# EAGLE design currentBaseBoard_v7 (EAGLE 9.5.1)
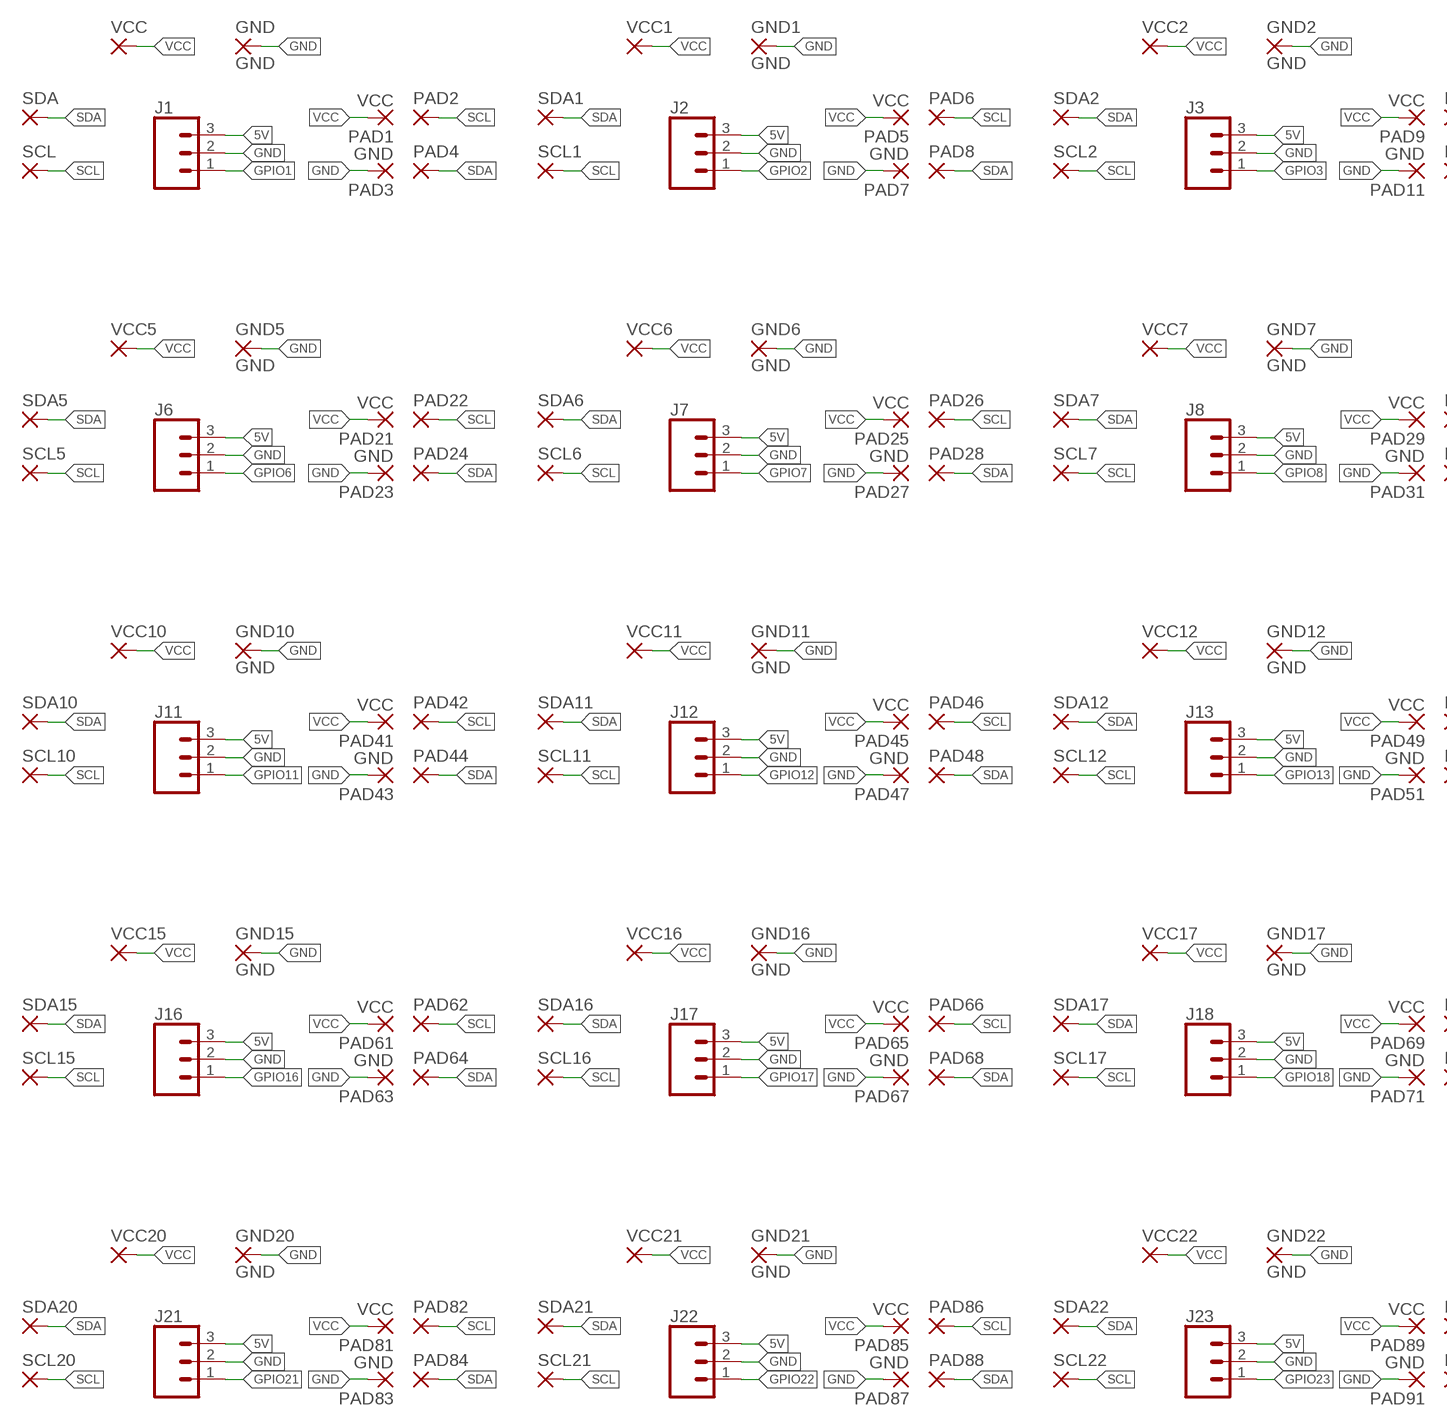
[diagram p0: schematic, sheet 1, part 1 of 2]
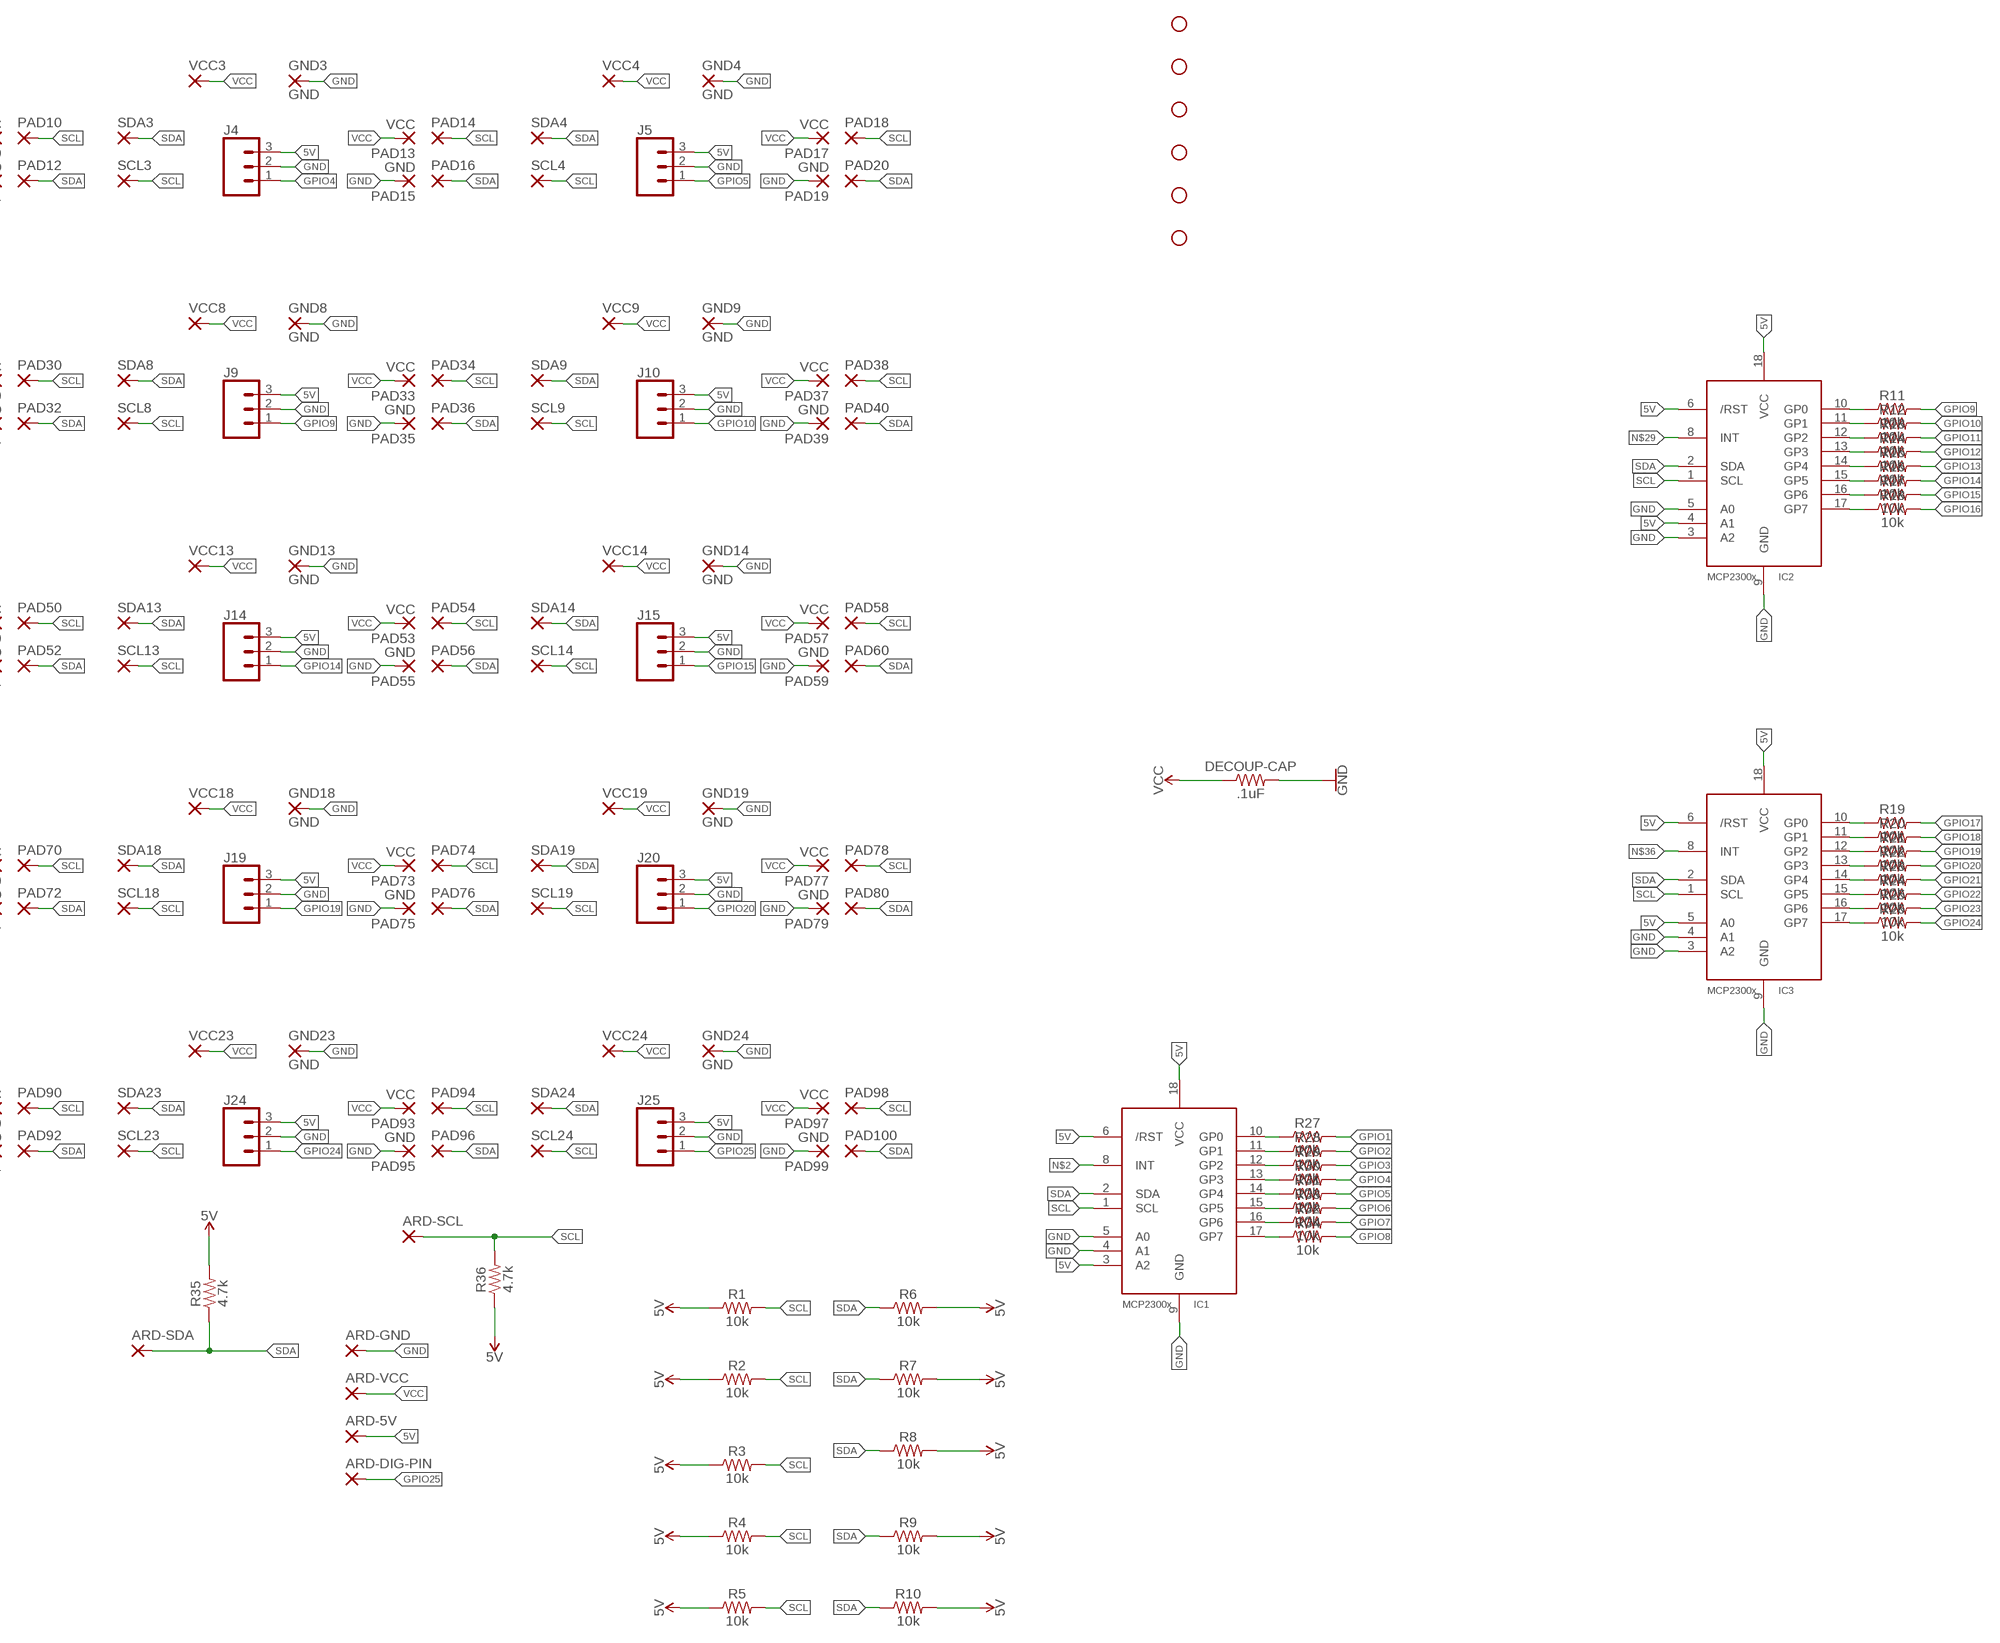
[diagram p1: schematic, sheet 1, part 2 of 2]

## Parts
ARD-5V  2,15/1,0  [2,15/1,0]
ARD-DIG-PIN  2,15/1,0  [2,15/1,0]
ARD-GND  2,15/1,0  [2,15/1,0]
ARD-SCL  2,15/1,0  [2,15/1,0]
ARD-SDA  2,15/1,0  [2,15/1,0]
ARD-VCC  2,15/1,0  [2,15/1,0]
DECOUP-CAP  .1uF  10KOHM-HORIZ-1/6W-5%  [AXIAL-0.3]
GND  GND  2,15/1,0  [2,15/1,0]
GND1  GND  2,15/1,0  [2,15/1,0]
GND2  GND  2,15/1,0  [2,15/1,0]
GND3  GND  2,15/1,0  [2,15/1,0]
GND4  GND  2,15/1,0  [2,15/1,0]
GND5  GND  2,15/1,0  [2,15/1,0]
GND6  GND  2,15/1,0  [2,15/1,0]
GND7  GND  2,15/1,0  [2,15/1,0]
GND8  GND  2,15/1,0  [2,15/1,0]
GND9  GND  2,15/1,0  [2,15/1,0]
GND10  GND  2,15/1,0  [2,15/1,0]
GND11  GND  2,15/1,0  [2,15/1,0]
GND12  GND  2,15/1,0  [2,15/1,0]
GND13  GND  2,15/1,0  [2,15/1,0]
GND14  GND  2,15/1,0  [2,15/1,0]
GND15  GND  2,15/1,0  [2,15/1,0]
GND16  GND  2,15/1,0  [2,15/1,0]
GND17  GND  2,15/1,0  [2,15/1,0]
GND18  GND  2,15/1,0  [2,15/1,0]
GND19  GND  2,15/1,0  [2,15/1,0]
GND20  GND  2,15/1,0  [2,15/1,0]
GND21  GND  2,15/1,0  [2,15/1,0]
GND22  GND  2,15/1,0  [2,15/1,0]
GND23  GND  2,15/1,0  [2,15/1,0]
GND24  GND  2,15/1,0  [2,15/1,0]
H1  STAND-OFF  [STAND-OFF]
H2  STAND-OFF  [STAND-OFF]
H3  STAND-OFF  [STAND-OFF]
H4  STAND-OFF  [STAND-OFF]
H5  STAND-OFF  [STAND-OFF]
H6  STAND-OFF  [STAND-OFF]
IC1  MCP23008/P  [DIL18]
IC2  MCP23008/P  [DIL18]
IC3  MCP23008/P  [DIL18]
J1  CONN_03  [1X03]
J2  CONN_03  [1X03]
J3  CONN_03  [1X03]
J4  CONN_03  [1X03]
J5  CONN_03  [1X03]
J6  CONN_03  [1X03]
J7  CONN_03  [1X03]
J8  CONN_03  [1X03]
J9  CONN_03  [1X03]
J10  CONN_03  [1X03]
J11  CONN_03  [1X03]
J12  CONN_03  [1X03]
J13  CONN_03  [1X03]
J14  CONN_03  [1X03]
J15  CONN_03  [1X03]
J16  CONN_03  [1X03]
J17  CONN_03  [1X03]
J18  CONN_03  [1X03]
J19  CONN_03  [1X03]
J20  CONN_03  [1X03]
J21  CONN_03  [1X03]
J22  CONN_03  [1X03]
J23  CONN_03  [1X03]
J24  CONN_03  [1X03]
J25  CONN_03  [1X03]
PAD1  VCC  2,15/1,0  [2,15/1,0]
PAD2  2,15/1,0  [2,15/1,0]
PAD3  GND  2,15/1,0  [2,15/1,0]
PAD4  2,15/1,0  [2,15/1,0]
PAD5  VCC  2,15/1,0  [2,15/1,0]
PAD6  2,15/1,0  [2,15/1,0]
PAD7  GND  2,15/1,0  [2,15/1,0]
PAD8  2,15/1,0  [2,15/1,0]
PAD9  VCC  2,15/1,0  [2,15/1,0]
PAD10  2,15/1,0  [2,15/1,0]
PAD11  GND  2,15/1,0  [2,15/1,0]
PAD12  2,15/1,0  [2,15/1,0]
PAD13  VCC  2,15/1,0  [2,15/1,0]
PAD14  2,15/1,0  [2,15/1,0]
PAD15  GND  2,15/1,0  [2,15/1,0]
PAD16  2,15/1,0  [2,15/1,0]
PAD17  VCC  2,15/1,0  [2,15/1,0]
PAD18  2,15/1,0  [2,15/1,0]
PAD19  GND  2,15/1,0  [2,15/1,0]
PAD20  2,15/1,0  [2,15/1,0]
PAD21  VCC  2,15/1,0  [2,15/1,0]
PAD22  2,15/1,0  [2,15/1,0]
PAD23  GND  2,15/1,0  [2,15/1,0]
PAD24  2,15/1,0  [2,15/1,0]
PAD25  VCC  2,15/1,0  [2,15/1,0]
PAD26  2,15/1,0  [2,15/1,0]
PAD27  GND  2,15/1,0  [2,15/1,0]
PAD28  2,15/1,0  [2,15/1,0]
PAD29  VCC  2,15/1,0  [2,15/1,0]
PAD30  2,15/1,0  [2,15/1,0]
PAD31  GND  2,15/1,0  [2,15/1,0]
PAD32  2,15/1,0  [2,15/1,0]
PAD33  VCC  2,15/1,0  [2,15/1,0]
PAD34  2,15/1,0  [2,15/1,0]
PAD35  GND  2,15/1,0  [2,15/1,0]
PAD36  2,15/1,0  [2,15/1,0]
PAD37  VCC  2,15/1,0  [2,15/1,0]
PAD38  2,15/1,0  [2,15/1,0]
PAD39  GND  2,15/1,0  [2,15/1,0]
PAD40  2,15/1,0  [2,15/1,0]
PAD41  VCC  2,15/1,0  [2,15/1,0]
PAD42  2,15/1,0  [2,15/1,0]
PAD43  GND  2,15/1,0  [2,15/1,0]
PAD44  2,15/1,0  [2,15/1,0]
PAD45  VCC  2,15/1,0  [2,15/1,0]
PAD46  2,15/1,0  [2,15/1,0]
PAD47  GND  2,15/1,0  [2,15/1,0]
PAD48  2,15/1,0  [2,15/1,0]
PAD49  VCC  2,15/1,0  [2,15/1,0]
PAD50  2,15/1,0  [2,15/1,0]
PAD51  GND  2,15/1,0  [2,15/1,0]
PAD52  2,15/1,0  [2,15/1,0]
PAD53  VCC  2,15/1,0  [2,15/1,0]
PAD54  2,15/1,0  [2,15/1,0]
PAD55  GND  2,15/1,0  [2,15/1,0]
PAD56  2,15/1,0  [2,15/1,0]
PAD57  VCC  2,15/1,0  [2,15/1,0]
PAD58  2,15/1,0  [2,15/1,0]
PAD59  GND  2,15/1,0  [2,15/1,0]
PAD60  2,15/1,0  [2,15/1,0]
PAD61  VCC  2,15/1,0  [2,15/1,0]
PAD62  2,15/1,0  [2,15/1,0]
PAD63  GND  2,15/1,0  [2,15/1,0]
PAD64  2,15/1,0  [2,15/1,0]
PAD65  VCC  2,15/1,0  [2,15/1,0]
PAD66  2,15/1,0  [2,15/1,0]
PAD67  GND  2,15/1,0  [2,15/1,0]
PAD68  2,15/1,0  [2,15/1,0]
PAD69  VCC  2,15/1,0  [2,15/1,0]
PAD70  2,15/1,0  [2,15/1,0]
PAD71  GND  2,15/1,0  [2,15/1,0]
PAD72  2,15/1,0  [2,15/1,0]
PAD73  VCC  2,15/1,0  [2,15/1,0]
PAD74  2,15/1,0  [2,15/1,0]
PAD75  GND  2,15/1,0  [2,15/1,0]
PAD76  2,15/1,0  [2,15/1,0]
PAD77  VCC  2,15/1,0  [2,15/1,0]
PAD78  2,15/1,0  [2,15/1,0]
PAD79  GND  2,15/1,0  [2,15/1,0]
PAD80  2,15/1,0  [2,15/1,0]
PAD81  VCC  2,15/1,0  [2,15/1,0]
PAD82  2,15/1,0  [2,15/1,0]
PAD83  GND  2,15/1,0  [2,15/1,0]
PAD84  2,15/1,0  [2,15/1,0]
PAD85  VCC  2,15/1,0  [2,15/1,0]
PAD86  2,15/1,0  [2,15/1,0]
PAD87  GND  2,15/1,0  [2,15/1,0]
PAD88  2,15/1,0  [2,15/1,0]
PAD89  VCC  2,15/1,0  [2,15/1,0]
PAD90  2,15/1,0  [2,15/1,0]
PAD91  GND  2,15/1,0  [2,15/1,0]
PAD92  2,15/1,0  [2,15/1,0]
PAD93  VCC  2,15/1,0  [2,15/1,0]
PAD94  2,15/1,0  [2,15/1,0]
PAD95  GND  2,15/1,0  [2,15/1,0]
PAD96  2,15/1,0  [2,15/1,0]
PAD97  VCC  2,15/1,0  [2,15/1,0]
PAD98  2,15/1,0  [2,15/1,0]
PAD99  GND  2,15/1,0  [2,15/1,0]
PAD100  2,15/1,0  [2,15/1,0]
R1  10k  10KOHM-HORIZ-1/4W-1%  [AXIAL-0.3]
R2  10k  10KOHM-HORIZ-1/4W-1%  [AXIAL-0.3]
R3  10k  10KOHM-HORIZ-1/4W-1%  [AXIAL-0.3]
R4  10k  10KOHM-HORIZ-1/4W-1%  [AXIAL-0.3]
R5  10k  10KOHM-HORIZ-1/4W-1%  [AXIAL-0.3]
R6  10k  10KOHM-HORIZ-1/4W-1%  [AXIAL-0.3]
R7  10k  10KOHM-HORIZ-1/4W-1%  [AXIAL-0.3]
R8  10k  10KOHM-HORIZ-1/4W-1%  [AXIAL-0.3]
R9  10k  10KOHM-HORIZ-1/4W-1%  [AXIAL-0.3]
R10  10k  10KOHM-HORIZ-1/4W-1%  [AXIAL-0.3]
R11  10k  10KOHM-HORIZ-1/6W-5%  [AXIAL-0.3]
R12  10k  10KOHM-HORIZ-1/6W-5%  [AXIAL-0.3]
R13  10k  10KOHM-HORIZ-1/6W-5%  [AXIAL-0.3]
R14  10k  10KOHM-HORIZ-1/6W-5%  [AXIAL-0.3]
R15  10k  10KOHM-HORIZ-1/6W-5%  [AXIAL-0.3]
R16  10k  10KOHM-HORIZ-1/6W-5%  [AXIAL-0.3]
R17  10k  10KOHM-HORIZ-1/6W-5%  [AXIAL-0.3]
R18  10k  10KOHM-HORIZ-1/6W-5%  [AXIAL-0.3]
R19  10k  10KOHM-HORIZ-1/6W-5%  [AXIAL-0.3]
R20  10k  10KOHM-HORIZ-1/6W-5%  [AXIAL-0.3]
R21  10k  10KOHM-HORIZ-1/6W-5%  [AXIAL-0.3]
R22  10k  10KOHM-HORIZ-1/6W-5%  [AXIAL-0.3]
R23  10k  10KOHM-HORIZ-1/6W-5%  [AXIAL-0.3]
R24  10k  10KOHM-HORIZ-1/6W-5%  [AXIAL-0.3]
R25  10k  10KOHM-HORIZ-1/6W-5%  [AXIAL-0.3]
R26  10k  10KOHM-HORIZ-1/6W-5%  [AXIAL-0.3]
R27  10k  10KOHM-HORIZ-1/6W-5%  [AXIAL-0.3]
R28  10k  10KOHM-HORIZ-1/6W-5%  [AXIAL-0.3]
R29  10k  10KOHM-HORIZ-1/6W-5%  [AXIAL-0.3]
R30  10k  10KOHM-HORIZ-1/6W-5%  [AXIAL-0.3]
R31  10k  10KOHM-HORIZ-1/6W-5%  [AXIAL-0.3]
R32  10k  10KOHM-HORIZ-1/6W-5%  [AXIAL-0.3]
R33  10k  10KOHM-HORIZ-1/6W-5%  [AXIAL-0.3]
R34  10k  10KOHM-HORIZ-1/6W-5%  [AXIAL-0.3]
R35  4.7k  10KOHM-HORIZ-1/4W-1%  [AXIAL-0.3]
R36  4.7k  10KOHM-HORIZ-1/4W-1%  [AXIAL-0.3]
SCL  2,15/1,0  [2,15/1,0]
SCL1  2,15/1,0  [2,15/1,0]
SCL2  2,15/1,0  [2,15/1,0]
SCL3  2,15/1,0  [2,15/1,0]
SCL4  2,15/1,0  [2,15/1,0]
SCL5  2,15/1,0  [2,15/1,0]
SCL6  2,15/1,0  [2,15/1,0]
SCL7  2,15/1,0  [2,15/1,0]
SCL8  2,15/1,0  [2,15/1,0]
SCL9  2,15/1,0  [2,15/1,0]
SCL10  2,15/1,0  [2,15/1,0]
SCL11  2,15/1,0  [2,15/1,0]
SCL12  2,15/1,0  [2,15/1,0]
SCL13  2,15/1,0  [2,15/1,0]
SCL14  2,15/1,0  [2,15/1,0]
SCL15  2,15/1,0  [2,15/1,0]
SCL16  2,15/1,0  [2,15/1,0]
SCL17  2,15/1,0  [2,15/1,0]
SCL18  2,15/1,0  [2,15/1,0]
SCL19  2,15/1,0  [2,15/1,0]
SCL20  2,15/1,0  [2,15/1,0]
SCL21  2,15/1,0  [2,15/1,0]
SCL22  2,15/1,0  [2,15/1,0]
SCL23  2,15/1,0  [2,15/1,0]
SCL24  2,15/1,0  [2,15/1,0]
SDA  2,15/1,0  [2,15/1,0]
SDA1  2,15/1,0  [2,15/1,0]
SDA2  2,15/1,0  [2,15/1,0]
SDA3  2,15/1,0  [2,15/1,0]
SDA4  2,15/1,0  [2,15/1,0]
SDA5  2,15/1,0  [2,15/1,0]
SDA6  2,15/1,0  [2,15/1,0]
SDA7  2,15/1,0  [2,15/1,0]
SDA8  2,15/1,0  [2,15/1,0]
SDA9  2,15/1,0  [2,15/1,0]
SDA10  2,15/1,0  [2,15/1,0]
SDA11  2,15/1,0  [2,15/1,0]
SDA12  2,15/1,0  [2,15/1,0]
SDA13  2,15/1,0  [2,15/1,0]
SDA14  2,15/1,0  [2,15/1,0]
SDA15  2,15/1,0  [2,15/1,0]
SDA16  2,15/1,0  [2,15/1,0]
SDA17  2,15/1,0  [2,15/1,0]
SDA18  2,15/1,0  [2,15/1,0]
SDA19  2,15/1,0  [2,15/1,0]
SDA20  2,15/1,0  [2,15/1,0]
SDA21  2,15/1,0  [2,15/1,0]
SDA22  2,15/1,0  [2,15/1,0]
SDA23  2,15/1,0  [2,15/1,0]
SDA24  2,15/1,0  [2,15/1,0]
VCC  2,15/1,0  [2,15/1,0]
VCC1  2,15/1,0  [2,15/1,0]
VCC2  2,15/1,0  [2,15/1,0]
VCC3  2,15/1,0  [2,15/1,0]
VCC4  2,15/1,0  [2,15/1,0]
VCC5  2,15/1,0  [2,15/1,0]
VCC6  2,15/1,0  [2,15/1,0]
VCC7  2,15/1,0  [2,15/1,0]
VCC8  2,15/1,0  [2,15/1,0]
VCC9  2,15/1,0  [2,15/1,0]
VCC10  2,15/1,0  [2,15/1,0]
VCC11  2,15/1,0  [2,15/1,0]
VCC12  2,15/1,0  [2,15/1,0]
VCC13  2,15/1,0  [2,15/1,0]
VCC14  2,15/1,0  [2,15/1,0]
VCC15  2,15/1,0  [2,15/1,0]
VCC16  2,15/1,0  [2,15/1,0]
VCC17  2,15/1,0  [2,15/1,0]
VCC18  2,15/1,0  [2,15/1,0]
VCC19  2,15/1,0  [2,15/1,0]
VCC20  2,15/1,0  [2,15/1,0]
VCC21  2,15/1,0  [2,15/1,0]
VCC22  2,15/1,0  [2,15/1,0]
VCC23  2,15/1,0  [2,15/1,0]
VCC24  2,15/1,0  [2,15/1,0]

## Nets
5V: ARD-5V.1(P) IC1.3(A2) IC1.6(/RST) IC1.18(VCC) IC2.4(A1) IC2.6(/RST) IC2.18(VCC) IC3.5(A0) IC3.6(/RST) IC3.18(VCC) J1.3 J2.3 J3.3 J4.3 J5.3 J6.3 J7.3 J8.3 J9.3 J10.3 J11.3 J12.3 J13.3 J14.3 J15.3 J16.3 J17.3 J18.3 J19.3 J20.3 J21.3 J22.3 J23.3 J24.3 J25.3 R1.P$1 R2.P$1 R3.P$1 R4.P$1 R5.P$1 R6.P$2 R7.P$2 R8.P$2 R9.P$2 R10.P$2 R35.P$2 R36.P$1
GND: ARD-GND.1(P) DECOUP-CAP.P$2 GND1.1(P) GND2.1(P) GND3.1(P) GND4.1(P) GND5.1(P) GND6.1(P) GND7.1(P) GND8.1(P) GND9.1(P) GND10.1(P) GND11.1(P) GND12.1(P) GND13.1(P) GND14.1(P) GND15.1(P) GND16.1(P) GND17.1(P) GND18.1(P) GND19.1(P) GND20.1(P) GND21.1(P) GND22.1(P) GND23.1(P) GND24.1(P) GND.1(P) IC1.4(A1) IC1.5(A0) IC1.9(GND) IC2.3(A2) IC2.5(A0) IC2.9(GND) IC3.3(A2) IC3.4(A1) IC3.9(GND) J1.2 J2.2 J3.2 J4.2 J5.2 J6.2 J7.2 J8.2 J9.2 J10.2 J11.2 J12.2 J13.2 J14.2 J15.2 J16.2 J17.2 J18.2 J19.2 J20.2 J21.2 J22.2 J23.2 J24.2 J25.2 PAD3.1(P) PAD7.1(P) PAD11.1(P) PAD15.1(P) PAD19.1(P) PAD23.1(P) PAD27.1(P) PAD31.1(P) PAD35.1(P) PAD39.1(P) PAD43.1(P) PAD47.1(P) PAD51.1(P) PAD55.1(P) PAD59.1(P) PAD63.1(P) PAD67.1(P) PAD71.1(P) PAD75.1(P) PAD79.1(P) PAD83.1(P) PAD87.1(P) PAD91.1(P) PAD95.1(P) PAD99.1(P)
GPIO1: J1.1 R27.P$2
GPIO2: J2.1 R28.P$2
GPIO3: J3.1 R29.P$2
GPIO4: J4.1 R30.P$2
GPIO5: J5.1 R31.P$2
GPIO6: J6.1 R33.P$2
GPIO7: J7.1 R32.P$2
GPIO8: J8.1 R34.P$2
GPIO9: J9.1 R11.P$2
GPIO10: J10.1 R12.P$2
GPIO11: J11.1 R13.P$2
GPIO12: J12.1 R14.P$2
GPIO13: J13.1 R15.P$2
GPIO14: J14.1 R16.P$2
GPIO15: J15.1 R17.P$2
GPIO16: J16.1 R18.P$2
GPIO17: J17.1 R19.P$2
GPIO18: J18.1 R20.P$2
GPIO19: J19.1 R21.P$2
GPIO20: J20.1 R22.P$2
GPIO21: J21.1 R23.P$2
GPIO22: J22.1 R24.P$2
GPIO23: J23.1 R25.P$2
GPIO24: J24.1 R26.P$2
GPIO25: ARD-DIG-PIN.1(P) J25.1
N$1: IC1.10(GP0) R27.P$1
N$2: IC1.8(INT)
N$3: IC1.11(GP1) R28.P$1
N$4: IC1.12(GP2) R29.P$1
N$5: IC1.13(GP3) R30.P$1
N$6: IC1.14(GP4) R31.P$1
N$7: IC1.15(GP5) R33.P$1
N$8: IC1.16(GP6) R32.P$1
N$9: IC1.17(GP7) R34.P$1
N$10: IC2.10(GP0) R11.P$1
N$12: IC2.11(GP1) R12.P$1
N$13: IC2.12(GP2) R13.P$1
N$14: IC2.13(GP3) R14.P$1
N$15: IC2.14(GP4) R15.P$1
N$16: IC2.15(GP5) R16.P$1
N$17: IC2.16(GP6) R17.P$1
N$18: IC2.17(GP7) R18.P$1
N$19: IC3.10(GP0) R19.P$1
N$20: IC3.11(GP1) R20.P$1
N$21: IC3.12(GP2) R21.P$1
N$22: IC3.13(GP3) R22.P$1
N$23: IC3.14(GP4) R23.P$1
N$24: IC3.15(GP5) R24.P$1
N$25: IC3.16(GP6) R25.P$1
N$26: IC3.17(GP7) R26.P$1
N$29: IC2.8(INT)
N$36: IC3.8(INT)
SCL: ARD-SCL.1(P) IC1.1(SCL) IC2.1(SCL) IC3.1(SCL) PAD2.1(P) PAD6.1(P) PAD10.1(P) PAD14.1(P) PAD18.1(P) PAD22.1(P) PAD26.1(P) PAD30.1(P) PAD34.1(P) PAD38.1(P) PAD42.1(P) PAD46.1(P) PAD50.1(P) PAD54.1(P) PAD58.1(P) PAD62.1(P) PAD66.1(P) PAD70.1(P) PAD74.1(P) PAD78.1(P) PAD82.1(P) PAD86.1(P) PAD90.1(P) PAD94.1(P) PAD98.1(P) R1.P$2 R2.P$2 R3.P$2 R4.P$2 R5.P$2 R36.P$2 SCL1.1(P) SCL2.1(P) SCL3.1(P) SCL4.1(P) SCL5.1(P) SCL6.1(P) SCL7.1(P) SCL8.1(P) SCL9.1(P) SCL10.1(P) SCL11.1(P) SCL12.1(P) SCL13.1(P) SCL14.1(P) SCL15.1(P) SCL16.1(P) SCL17.1(P) SCL18.1(P) SCL19.1(P) SCL20.1(P) SCL21.1(P) SCL22.1(P) SCL23.1(P) SCL24.1(P) SCL.1(P)
SDA: ARD-SDA.1(P) IC1.2(SDA) IC2.2(SDA) IC3.2(SDA) PAD4.1(P) PAD8.1(P) PAD12.1(P) PAD16.1(P) PAD20.1(P) PAD24.1(P) PAD28.1(P) PAD32.1(P) PAD36.1(P) PAD40.1(P) PAD44.1(P) PAD48.1(P) PAD52.1(P) PAD56.1(P) PAD60.1(P) PAD64.1(P) PAD68.1(P) PAD72.1(P) PAD76.1(P) PAD80.1(P) PAD84.1(P) PAD88.1(P) PAD92.1(P) PAD96.1(P) PAD100.1(P) R6.P$1 R7.P$1 R8.P$1 R9.P$1 R10.P$1 R35.P$1 SDA1.1(P) SDA2.1(P) SDA3.1(P) SDA4.1(P) SDA5.1(P) SDA6.1(P) SDA7.1(P) SDA8.1(P) SDA9.1(P) SDA10.1(P) SDA11.1(P) SDA12.1(P) SDA13.1(P) SDA14.1(P) SDA15.1(P) SDA16.1(P) SDA17.1(P) SDA18.1(P) SDA19.1(P) SDA20.1(P) SDA21.1(P) SDA22.1(P) SDA23.1(P) SDA24.1(P) SDA.1(P)
VCC: ARD-VCC.1(P) DECOUP-CAP.P$1 PAD1.1(P) PAD5.1(P) PAD9.1(P) PAD13.1(P) PAD17.1(P) PAD21.1(P) PAD25.1(P) PAD29.1(P) PAD33.1(P) PAD37.1(P) PAD41.1(P) PAD45.1(P) PAD49.1(P) PAD53.1(P) PAD57.1(P) PAD61.1(P) PAD65.1(P) PAD69.1(P) PAD73.1(P) PAD77.1(P) PAD81.1(P) PAD85.1(P) PAD89.1(P) PAD93.1(P) PAD97.1(P) VCC1.1(P) VCC2.1(P) VCC3.1(P) VCC4.1(P) VCC5.1(P) VCC6.1(P) VCC7.1(P) VCC8.1(P) VCC9.1(P) VCC10.1(P) VCC11.1(P) VCC12.1(P) VCC13.1(P) VCC14.1(P) VCC15.1(P) VCC16.1(P) VCC17.1(P) VCC18.1(P) VCC19.1(P) VCC20.1(P) VCC21.1(P) VCC22.1(P) VCC23.1(P) VCC24.1(P) VCC.1(P)

## Library data of the parts
ARD-5V ARD-DIG-PIN ARD-GND ARD-SCL ARD-SDA ARD-VCC GND GND1-GND24 PAD1-PAD100 SCL SCL1-SCL24 SDA SDA1-SDA24 VCC VCC1-VCC24 = wirepad:2,15/1,0: THROUGH-HOLE PAD
DECOUP-CAP = SparkFun-Resistors:10KOHM: 10kΩ resistor A resistor is a passive two-terminal electrical component that implements electrical resistance as a circuit element. Resistors act to reduce current flow, and, at the same time, act to lower voltage levels within circuits. - Wikipedia; PROD_ID: RES-08375; VALUE: 10k
H1-H6 = SparkFun-Hardware:STAND-OFF: Stand Off Drill holes for mechanically mounting via screws, standoffs, etc. Note: Use the keepout ring to avoid running the screw head into surrounding components. Variant Overviews STAND-OFF - Mechanical footprint for a #4 phillips button head screw. STAND-OFF-TIGHT - Mechanical footprint for a #4 phillips button head screw, Example SparkFun Products Screw - Phillips Head (1/4", 4-40, 10 pack) <https://www.sparkfun.com/products/10453> (PRT-10453) Screw - Phillips Head (1/2", 4-40, 10 pack) <https://www.sparkfun.com/products/10452> (PRT-10452) Screw - Phillips Head (3/4", 4-40, 10 pack) <https://www.sparkfun.com/products/10451> (PRT-10451) Screw - Phillips Head (1", 4-40, 10 pack) <https://www.sparkfun.com/products/10450> (PRT-10450)
IC1-IC3 = adafruit:MCP23008: MCP23008 Inexpensive i2c i/o expander - 8 general purpose i/o pins with optional pullups
J1-J25 = SparkFun-Connectors:CONN_03: Multi connection point. Often used as Generic Header-pin footprint for 0.1 inch spaced/style header connections On any of the 0.1 inch spaced packages, you can populate with these: Break Away Headers - Straight <https://www.sparkfun.com/products/116> (PRT-00116) Break Away Male Headers - Right Angle <https://www.sparkfun.com/products/553> (PRT-00553) Female Headers <https://www.sparkfun.com/products/115> (PRT-00115) Break Away Headers - Machine Pin <https://www.sparkfun.com/products/117> (PRT-00117) Break Away Female Headers - Swiss Machine Pin <https://www.sparkfun.com/products/743> (PRT-00743) Stackable Header - 3 Pin (Female, 0.1") <https://www.sparkfun.com/products/13875> (PRT-13875) For SCREWTERMINALS and SPRING TERMINALS visit here: Screw Terimnals on SparkFun.com <https://www.sparkfun.com/search/results?term=Screw+Terminals> (5mm/3.5mm/2.54mm spacing) This device is also useful as a general connection point to wire up your design to another part of your project. Our various solder wires solder well into these plated through hole pads. Hook-Up Wire - Assortment (Stranded, 22 AWG) <https://www.sparkfun.com/products/11375> (PRT-11375) Hook-Up Wire - Assortment (Solid Core, 22 AWG) <https://www.sparkfun.com/products/11367> (PRT-11367) View the entire wire category on our website here <https://www.sparkfun.com/categories/141> Special notes: Molex polarized connector foot print use with SKU : PRT-08232 with associated crimp pins and housings.
R1-R10 = SparkFun-Resistors:10KOHM: 10kΩ resistor A resistor is a passive two-terminal electrical component that implements electrical resistance as a circuit element. Resistors act to reduce current flow, and, at the same time, act to lower voltage levels within circuits. - Wikipedia; PROD_ID: RES-12183
R11-R34 = SparkFun-Resistors:10KOHM: 10kΩ resistor A resistor is a passive two-terminal electrical component that implements electrical resistance as a circuit element. Resistors act to reduce current flow, and, at the same time, act to lower voltage levels within circuits. - Wikipedia; PROD_ID: RES-08375
R35 R36 = SparkFun-Resistors:10KOHM: 10kΩ resistor A resistor is a passive two-terminal electrical component that implements electrical resistance as a circuit element. Resistors act to reduce current flow, and, at the same time, act to lower voltage levels within circuits. - Wikipedia; PROD_ID: RES-12183; VALUE: 10k

## Board
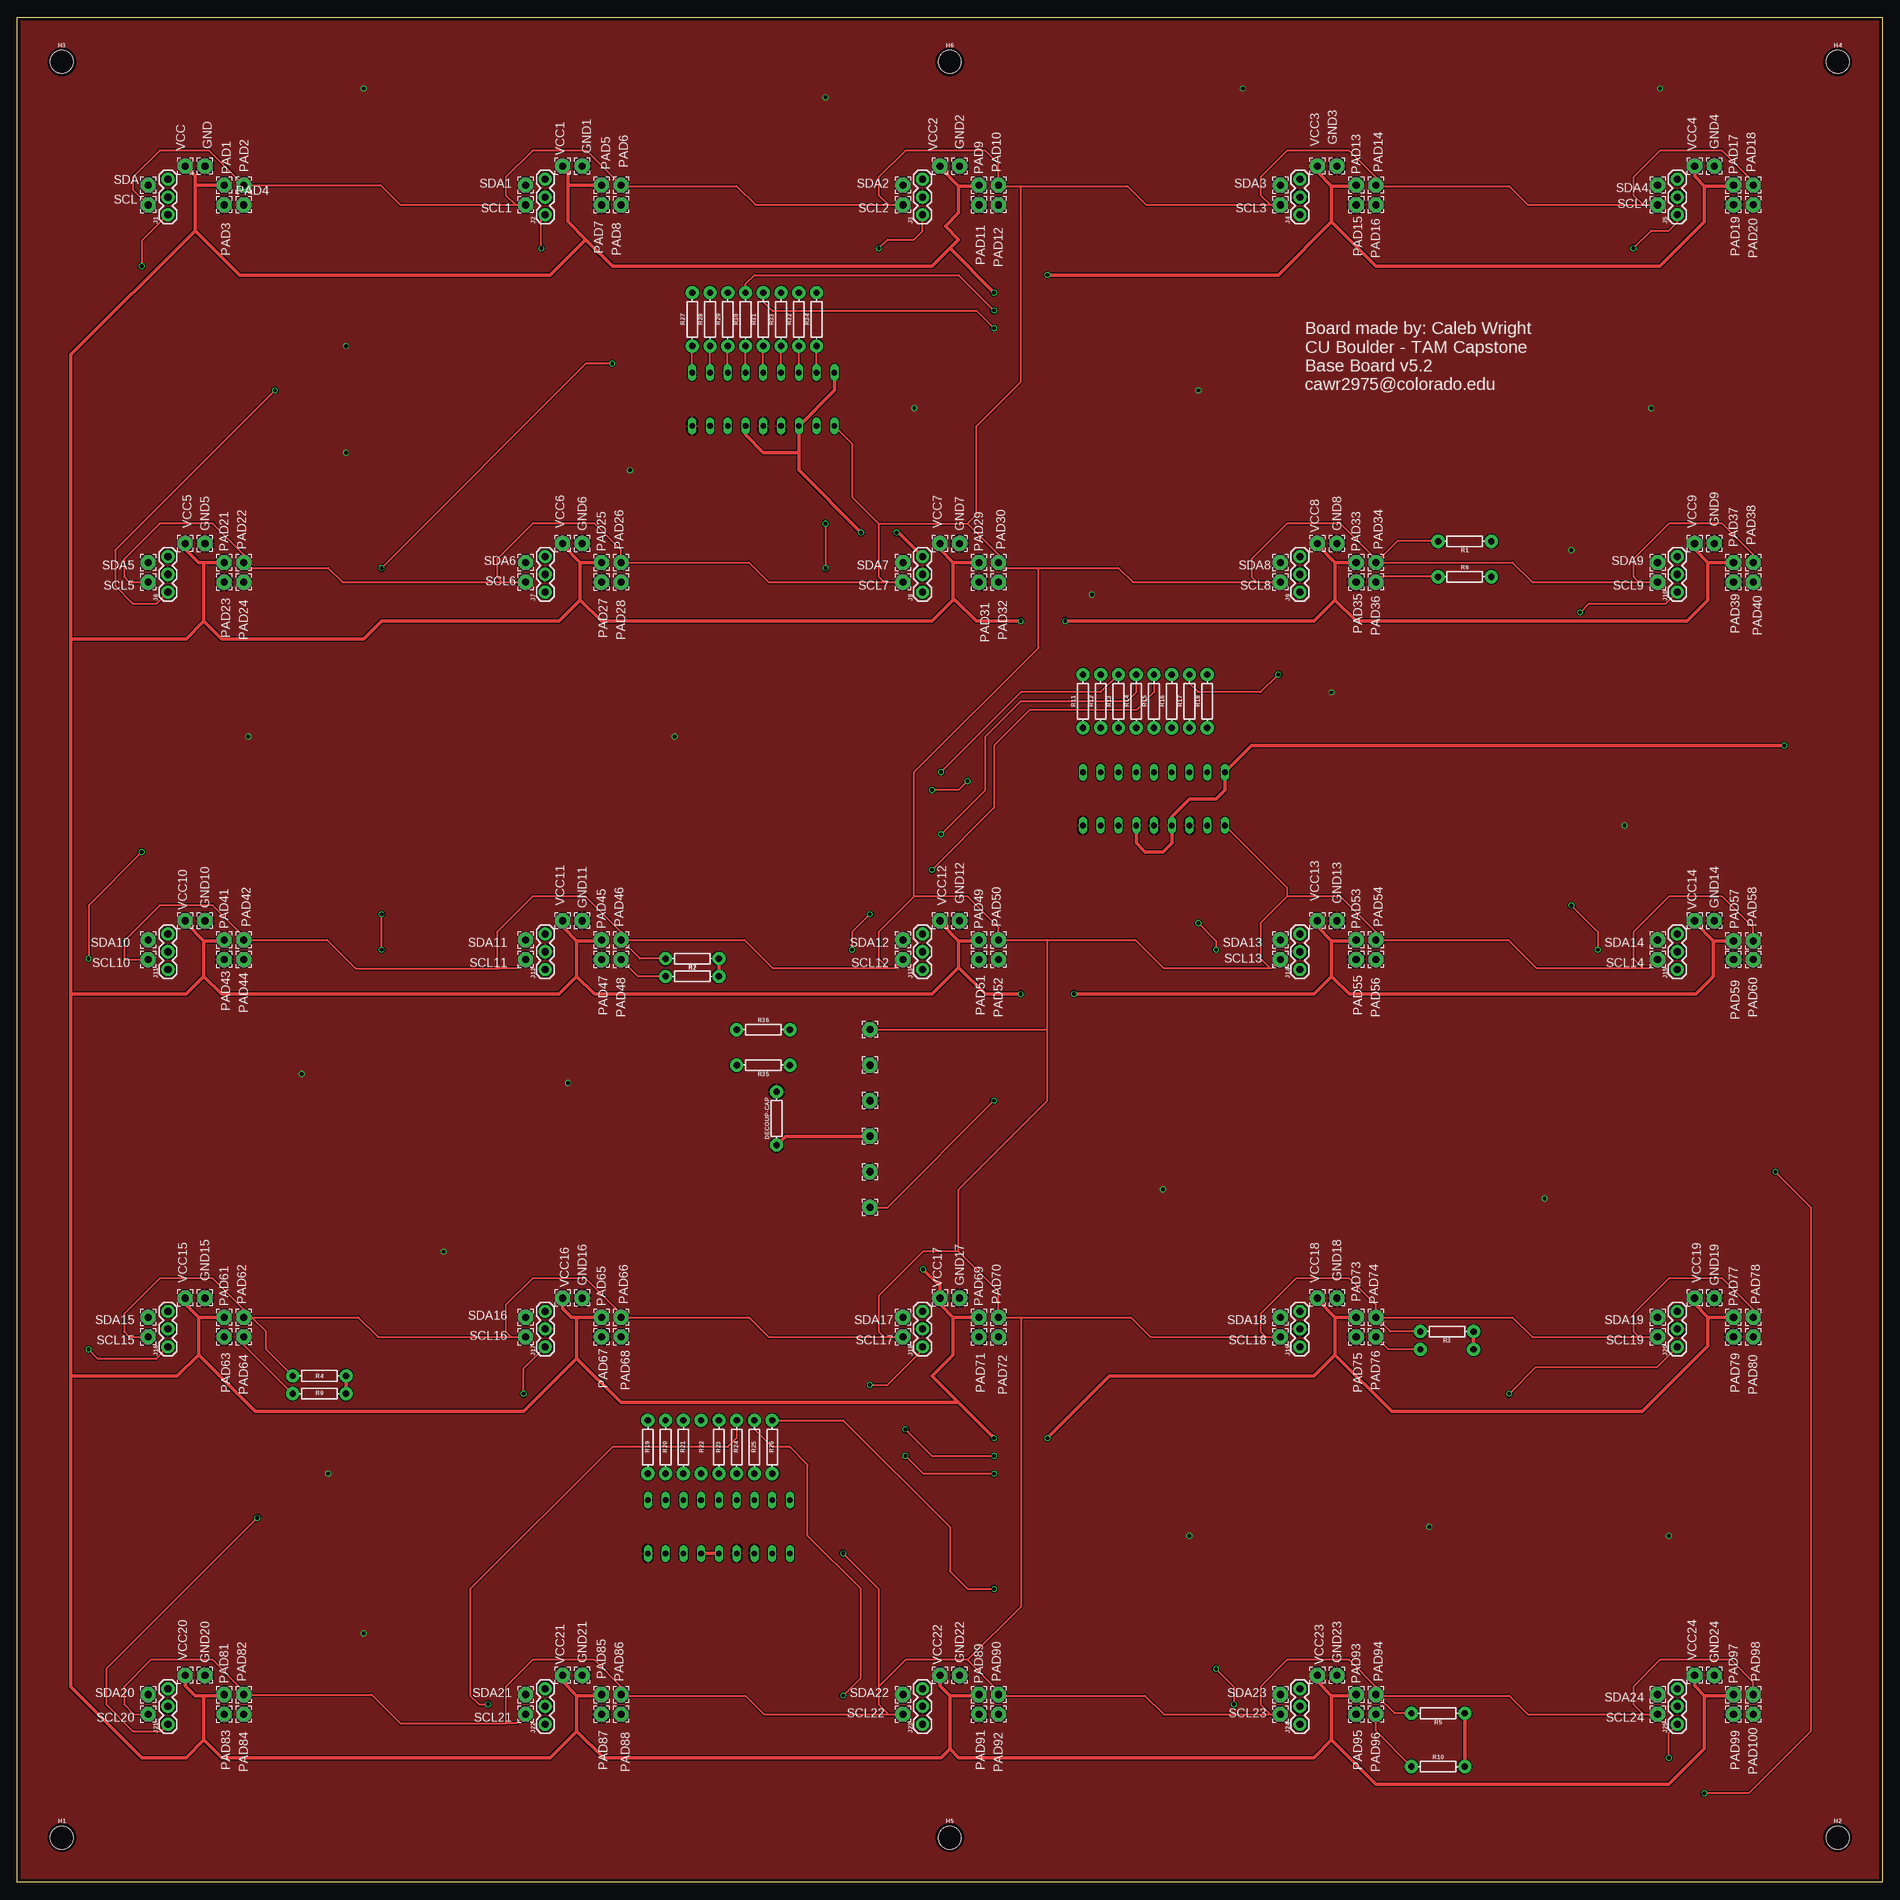
[diagram p2: board, top side]
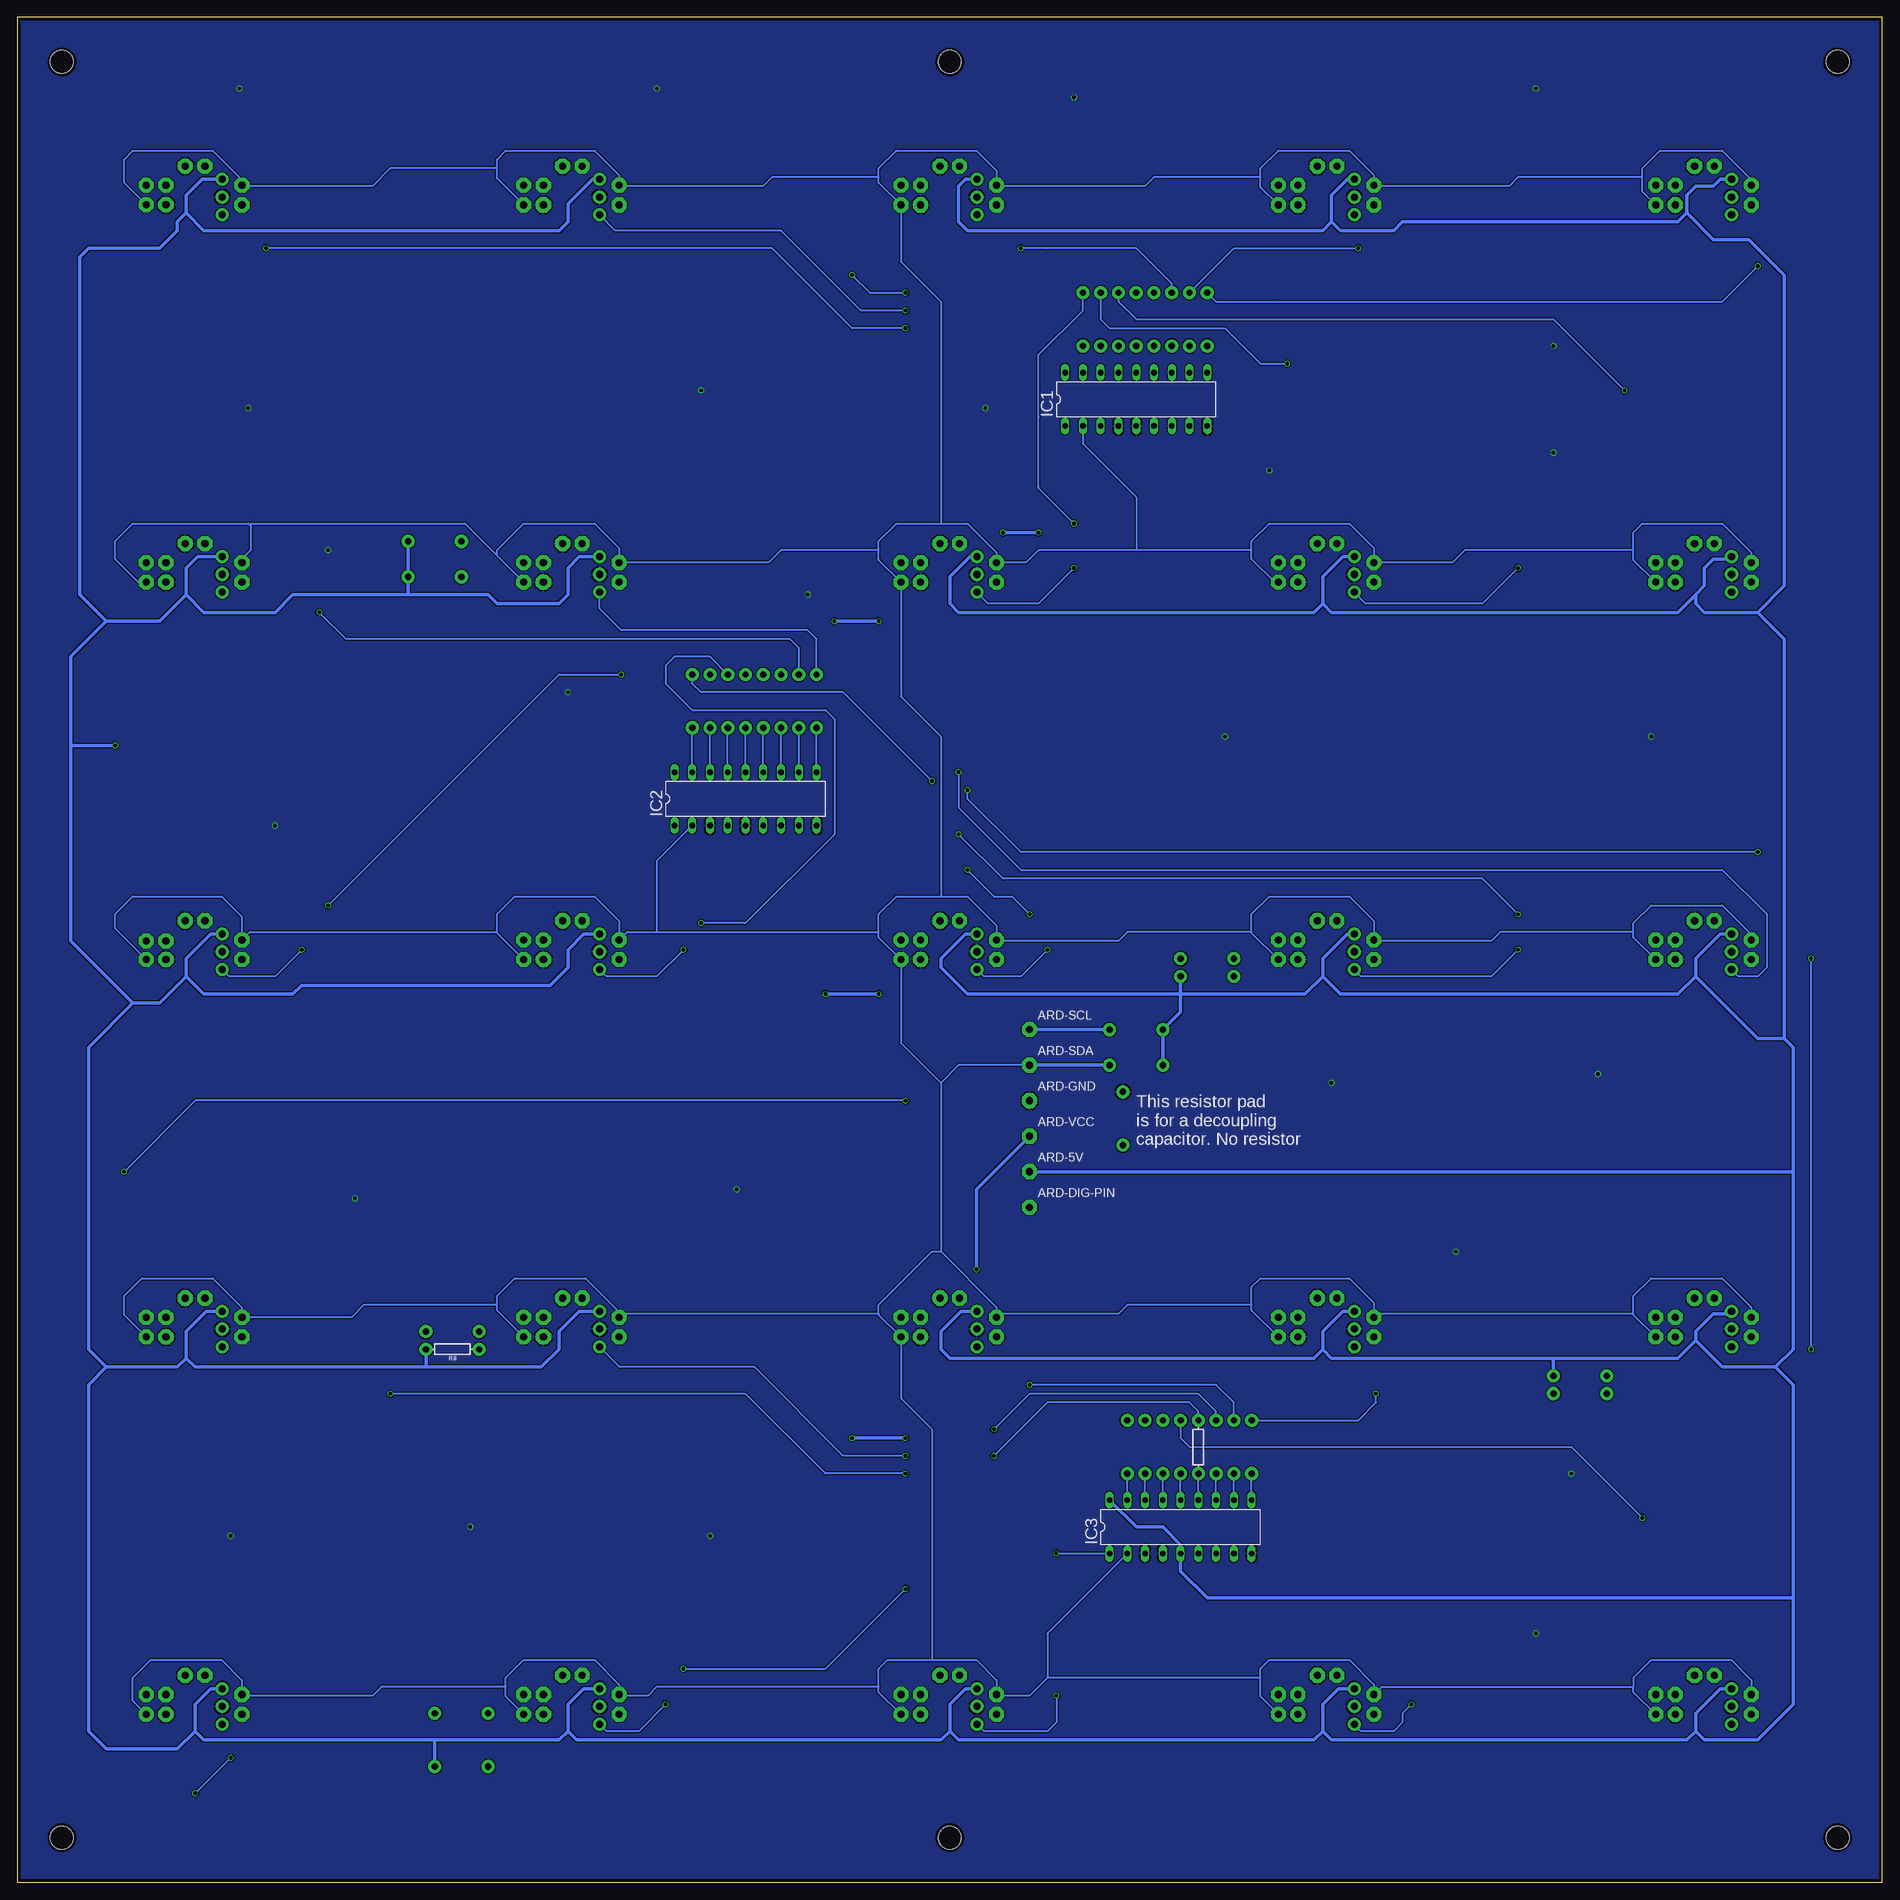
[diagram p3: board, bottom side, seen from below]

Size 266.7 x 266.7 mm. Coordinates in mm from the lower left corner, seen from the top.
Outline: 0,0 0,266.7 266.7,266.7 266.7,0 0,0
Copper layers (1*16): Top 0.035559375mm / dielectric 1.6mm / Bottom 0.035559375mm
Design rules "OSH_2Layer": minimum track width 6mil, minimum drill 10mil, track to track 6mil, track to pad 6mil, pad to pad 6mil, via to via 6mil, smd to smd 6mil, copper to edge 15mil, drill to drill 6mil, minimum pad ring 5mil, minimum via ring 5mil, stop-mask expansion 2.5mil, vias tented up to drill 0mil, thermal gap 10mil

### Footprints (pad centres in the part's own frame; a part is rotated, then mirrored left to right if it is on the bottom)
2,15/1,0 = drill 1.016 pad 2.159 octagon: 1 0,0
AXIAL-0.3 = drill 0.9 pad 1.88: P$1 -3.81,0; P$2 3.81,0
STAND-OFF = hole 3.302: 0,0
DIL18 = drill 0.813 long: 1 -10.16,-3.81; 2 -7.62,-3.81; 3 -5.08,-3.81; 4 -2.54,-3.81; 5 0,-3.81; 6 2.54,-3.81; 7 5.08,-3.81; 8 7.62,-3.81; 9 10.16,-3.81; 10 10.16,3.81; 11 7.62,3.81; 12 5.08,3.81; 13 2.54,3.81; 14 0,3.81; 15 -2.54,3.81; 16 -5.08,3.81; 17 -7.62,3.81; 18 -10.16,3.81
1X03 = drill 1.016 pad 1.88: 1 0,0; 2 2.54,0; 3 5.08,0

### Placement (x,y rotation side)
ARD-5V  121.92,101.6 0 top
ARD-DIG-PIN  121.92,96.52 0 top
ARD-GND  121.92,111.76 0 top
ARD-SCL  121.92,121.92 0 top
ARD-SDA  121.92,116.84 0 top
ARD-VCC  121.92,106.68 0 top
DECOUP-CAP  108.58,109.22 90 top
GND  26.81,245.45 0 top
GND1  80.79,245.45 0 top
GND2  134.76,245.45 0 top
GND3  188.74,245.45 0 top
GND4  242.71,245.45 0 top
GND5  26.81,191.47 0 top
GND6  80.79,191.47 0 top
GND7  134.76,191.47 0 top
GND8  188.74,191.47 0 top
GND9  242.71,191.47 0 top
GND10  26.81,137.5 0 top
GND11  80.79,137.5 0 top
GND12  134.76,137.5 0 top
GND13  188.74,137.5 0 top
GND14  242.71,137.5 0 top
GND15  26.81,83.52 0 top
GND16  80.79,83.52 0 top
GND17  134.76,83.52 0 top
GND18  188.74,83.52 0 top
GND19  242.71,83.52 0 top
GND20  26.81,29.55 0 top
GND21  80.79,29.55 0 top
GND22  134.76,29.55 0 top
GND23  188.74,29.55 0 top
GND24  242.71,29.55 0 top
H1  6.35,6.35 0 top
H2  260.35,6.35 0 top
H3  6.35,260.35 0 top
H4  260.35,260.35 0 top
H5  133.35,6.35 0 top
H6  133.35,260.35 0 top
IC1  106.68,212.09 0 bottom
IC2  162.56,154.94 0 bottom
IC3  100.33,50.8 0 bottom
J1  21.52,238.48 90 top
J2  75.49,238.48 90 top
J3  129.47,238.48 90 top
J4  183.44,238.48 90 top
J5  237.42,238.48 90 top
J6  21.52,184.5 90 top
J7  75.49,184.5 90 top
J8  129.47,184.5 90 top
J9  183.44,184.5 90 top
J10  237.42,184.5 90 top
J11  21.52,130.53 90 top
J12  75.49,130.53 90 top
J13  129.47,130.53 90 top
J14  183.44,130.53 90 top
J15  237.42,130.53 90 top
J16  21.52,76.55 90 top
J17  75.49,76.55 90 top
J18  129.47,76.55 90 top
J19  183.44,76.55 90 top
J20  237.42,76.55 90 top
J21  21.52,22.58 90 top
J22  75.49,22.58 90 top
J23  129.47,22.58 90 top
J24  183.44,22.58 90 top
J25  237.42,22.58 90 top
PAD1  29.56,242.71 0 top
PAD2  32.38,242.71 0 top
PAD3  29.56,239.89 0 top
PAD4  32.38,239.89 0 top
PAD5  83.53,242.71 0 top
PAD6  86.35,242.71 0 top
PAD7  83.53,239.89 0 top
PAD8  86.35,239.89 0 top
PAD9  137.51,242.71 0 top
PAD10  140.33,242.71 0 top
PAD11  137.51,239.89 0 top
PAD12  140.33,239.89 0 top
PAD13  191.48,242.71 0 top
PAD14  194.3,242.71 0 top
PAD15  191.48,239.89 0 top
PAD16  194.3,239.89 0 top
PAD17  245.46,242.71 0 top
PAD18  248.28,242.71 0 top
PAD19  245.46,239.9 0 top
PAD20  248.28,239.9 0 top
PAD21  29.56,188.74 0 top
PAD22  32.38,188.74 0 top
PAD23  29.56,185.91 0 top
PAD24  32.38,185.91 0 top
PAD25  83.53,188.74 0 top
PAD26  86.35,188.74 0 top
PAD27  83.53,185.91 0 top
PAD28  86.35,185.91 0 top
PAD29  137.51,188.74 0 top
PAD30  140.33,188.74 0 top
PAD31  137.51,185.91 0 top
PAD32  140.33,185.91 0 top
PAD33  191.48,188.74 0 top
PAD34  194.3,188.74 0 top
PAD35  191.48,185.91 0 top
PAD36  194.3,185.91 0 top
PAD37  245.46,188.74 0 top
PAD38  248.28,188.74 0 top
PAD39  245.46,185.91 0 top
PAD40  248.28,185.91 0 top
PAD41  29.56,134.76 0 top
PAD42  32.38,134.76 0 top
PAD43  29.56,131.93 0 top
PAD44  32.38,131.94 0 top
PAD45  83.53,134.76 0 top
PAD46  86.35,134.76 0 top
PAD47  83.53,131.94 0 top
PAD48  86.35,131.94 0 top
PAD49  137.51,134.76 0 top
PAD50  140.33,134.76 0 top
PAD51  137.51,131.94 0 top
PAD52  140.33,131.94 0 top
PAD53  191.48,134.76 0 top
PAD54  194.3,134.76 0 top
PAD55  191.48,131.94 0 top
PAD56  194.3,131.94 0 top
PAD57  245.46,134.62 0 top
PAD58  248.28,134.62 0 top
PAD59  245.46,131.94 0 top
PAD60  248.28,131.94 0 top
PAD61  29.56,80.79 0 top
PAD62  32.38,80.79 0 top
PAD63  29.56,77.96 0 top
PAD64  32.38,77.96 0 top
PAD65  83.53,80.79 0 top
PAD66  86.35,80.79 0 top
PAD67  83.53,77.96 0 top
PAD68  86.35,77.96 0 top
PAD69  137.51,80.79 0 top
PAD70  140.33,80.79 0 top
PAD71  137.51,77.96 0 top
PAD72  140.33,77.96 0 top
PAD73  191.48,80.79 0 top
PAD74  194.3,80.79 0 top
PAD75  191.48,77.96 0 top
PAD76  194.3,77.96 0 top
PAD77  245.46,80.79 0 top
PAD78  248.28,80.79 0 top
PAD79  245.46,77.96 0 top
PAD80  248.28,77.96 0 top
PAD81  29.56,26.81 0 top
PAD82  32.38,26.81 0 top
PAD83  29.56,23.99 0 top
PAD84  32.38,23.99 0 top
PAD85  83.53,26.81 0 top
PAD86  86.35,26.81 0 top
PAD87  83.53,23.99 0 top
PAD88  86.35,23.99 0 top
PAD89  137.51,26.81 0 top
PAD90  140.33,26.81 0 top
PAD91  137.51,23.99 0 top
PAD92  140.33,23.99 0 top
PAD93  191.48,26.81 0 top
PAD94  194.3,26.81 0 top
PAD95  191.48,23.99 0 top
PAD96  194.3,23.99 0 top
PAD97  245.46,26.81 0 top
PAD98  248.28,26.81 0 top
PAD99  245.46,23.99 0 top
PAD100  248.28,23.99 0 top
R1  207.01,191.77 180 top
R2  96.52,132.08 180 top
R3  204.47,78.74 180 top
R4  43.18,72.39 180 top
R5  203.2,24.13 180 top
R6  207.01,186.69 0 top
R7  96.52,129.54 0 top
R8  204.47,76.2 180 bottom
R9  43.18,69.85 0 top
R10  203.2,16.51 0 top
R11  152.4,168.91 90 top
R12  154.94,168.91 90 top
R13  157.48,168.91 90 top
R14  160.02,168.91 90 top
R15  162.56,168.91 90 top
R16  165.1,168.91 90 top
R17  167.64,168.91 90 top
R18  170.18,168.91 90 top
R19  90.17,62.23 90 top
R20  92.71,62.23 90 top
R21  95.25,62.23 90 top
R22  97.79,62.23 90 bottom
R23  100.33,62.23 90 top
R24  102.87,62.23 90 top
R25  105.41,62.23 90 top
R26  107.95,62.23 90 top
R27  96.52,223.52 90 top
R28  99.06,223.52 90 top
R29  101.6,223.52 90 top
R30  104.14,223.52 90 top
R31  106.68,223.52 90 top
R32  111.76,223.52 90 top
R33  109.22,223.52 90 top
R34  114.3,223.52 90 top
R35  106.68,116.84 180 top
R36  106.68,121.92 0 top
SCL  18.7,239.89 0 top
SCL1  72.67,239.89 0 top
SCL2  126.65,239.89 0 top
SCL3  180.62,239.89 0 top
SCL4  234.6,239.89 0 top
SCL5  18.7,185.91 0 top
SCL6  72.67,185.91 0 top
SCL7  126.65,185.91 0 top
SCL8  180.62,185.91 0 top
SCL9  234.6,185.91 0 top
SCL10  18.7,131.94 0 top
SCL11  72.67,131.94 0 top
SCL12  126.65,131.94 0 top
SCL13  180.62,131.94 0 top
SCL14  234.6,131.94 0 top
SCL15  18.7,77.96 0 top
SCL16  72.67,77.96 0 top
SCL17  126.65,77.96 0 top
SCL18  180.62,77.96 0 top
SCL19  234.6,77.96 0 top
SCL20  18.7,23.99 0 top
SCL21  72.67,23.99 0 top
SCL22  126.65,23.99 0 top
SCL23  180.62,23.99 0 top
SCL24  234.6,23.99 0 top
SDA  18.7,242.71 0 top
SDA1  72.67,242.71 0 top
SDA2  126.65,242.71 0 top
SDA3  180.62,242.71 0 top
SDA4  234.6,242.71 0 top
SDA5  18.7,188.74 0 top
SDA6  72.67,188.74 0 top
SDA7  126.65,188.74 0 top
SDA8  180.62,188.74 0 top
SDA9  234.6,188.74 0 top
SDA10  18.7,134.76 0 top
SDA11  72.67,134.76 0 top
SDA12  126.65,134.76 0 top
SDA13  180.62,134.76 0 top
SDA14  234.6,134.76 0 top
SDA15  18.7,80.79 0 top
SDA16  72.67,80.79 0 top
SDA17  126.65,80.79 0 top
SDA18  180.62,80.79 0 top
SDA19  234.6,80.79 0 top
SDA20  18.7,26.81 0 top
SDA21  72.67,26.81 0 top
SDA22  126.65,26.81 0 top
SDA23  180.62,26.81 0 top
SDA24  234.6,26.81 0 top
VCC  23.99,245.45 0 top
VCC1  77.96,245.45 0 top
VCC2  131.94,245.45 0 top
VCC3  185.91,245.45 0 top
VCC4  239.89,245.45 0 top
VCC5  23.99,191.47 0 top
VCC6  77.96,191.47 0 top
VCC7  131.94,191.47 0 top
VCC8  185.91,191.47 0 top
VCC9  239.89,191.47 0 top
VCC10  23.99,137.5 0 top
VCC11  77.96,137.5 0 top
VCC12  131.94,137.5 0 top
VCC13  185.91,137.5 0 top
VCC14  239.89,137.5 0 top
VCC15  23.99,83.52 0 top
VCC16  77.96,83.52 0 top
VCC17  131.94,83.52 0 top
VCC18  185.91,83.52 0 top
VCC19  239.89,83.52 0 top
VCC20  23.99,29.55 0 top
VCC21  77.96,29.55 0 top
VCC22  131.94,29.55 0 top
VCC23  185.91,29.55 0 top
VCC24  239.89,29.55 0 top

### Tracks (layer width: path | path; a pad name or v marks a point on that pad's centre or on a via)
5V  (via drill 0.55)
  Top 0.508: IC1.18 116.84,213.36 IC1.3 111.76,204.47 | v120.65,193.04 111.76,201.93 111.76,204.47 | v125.73,193.04 126.01,193.04 J8.3 | v252.73,162.56 176.53,162.56 IC2.18 172.72,156.21 171.45,154.94 167.64,154.94 165.1,152.4 IC2.4 165.1,148.59 163.83,147.32 161.29,147.32 160.02,148.59 IC2.6 | R2.P$1 R7.P$2 | R3.P$1 R8.P$2 | R5.P$1 R10.P$2 | R4.P$1 R9.P$2 | IC1.6 104.14,207.01 106.68,204.47 111.76,204.47 | IC3.6 IC3.5
  Bottom 0.508: J1.3 23.14,243.56 24.13,242.57 26.67,242.57 27.94,241.3 27.94,238.76 | 27.94,238.76 29.21,237.49 68.58,237.49 69.85,236.22 77.47,236.22 78.74,237.49 | 78.74,237.49 78.74,241.3 76.48,243.56 J2.3 | 78.74,237.49 80.01,236.22 130.81,236.22 132.08,237.49 132.08,242.57 131.09,243.56 J3.3 | J6.3 21.87,189.23 24.13,189.23 25.4,187.96 25.4,185.42 26.67,184.15 | 80.01,182.88 78.74,181.61 29.21,181.61 26.67,184.15 | 80.01,182.88 80.01,186.69 77.12,189.58 J7.3 | 80.01,182.88 81.28,181.61 132.08,181.61 133.35,182.88 133.35,186.69 130.46,189.58 J8.3 | J11.3 23.14,135.61 26.67,132.08 26.67,129.54 | 26.67,129.54 29.21,127 77.47,127 80.01,129.54 | 80.01,129.54 80.01,132.08 76.48,135.61 J12.3 | 80.01,129.54 82.55,127 100.33,127 | 100.33,127 130.81,127 134.62,130.81 134.62,132.08 131.09,135.61 J13.3 | J16.3 21.87,81.28 24.13,81.28 26.67,78.74 26.67,77.47 | 46.99,74.93 29.21,74.93 26.67,77.47 | 46.99,74.93 78.74,74.93 80.01,76.2 | 80.01,76.2 80.01,78.74 77.12,81.63 J17.3 | 80.01,76.2 81.28,74.93 133.35,74.93 134.62,76.2 134.62,78.74 131.73,81.63 J18.3 | J21.3 23.14,27.66 26.67,24.13 26.67,21.59 | 26.67,21.59 27.94,20.32 78.74,20.32 80.01,21.59 | 80.01,21.59 80.01,25.4 77.75,27.66 J22.3 | 80.01,21.59 81.28,20.32 132.08,20.32 133.35,21.59 | 133.35,21.59 133.35,25.4 131.09,27.66 J23.3 | 133.35,21.59 134.62,20.32 186.69,20.32 187.96,21.59 | 187.96,21.59 187.96,25.4 185.7,27.66 J24.3 | 187.96,21.59 189.23,20.32 207.01,20.32 | 207.01,20.32 240.03,20.32 241.3,21.59 | 241.3,21.59 241.3,25.4 239.04,27.66 J25.3 | 26.67,21.59 25.4,20.32 17.78,20.32 12.7,25.4 12.7,40.64 | 15.24,73.66 12.7,71.12 12.7,40.64
  Bottom 0.508: 15.24,73.66 22.86,73.66 26.67,77.47 | 15.24,73.66 12.7,76.2 12.7,101.6 | 12.7,101.6 12.7,119.38 13.97,120.65 | 26.67,129.54 17.78,120.65 13.97,120.65 | 13.97,120.65 13.97,177.8 17.78,181.61 | 17.78,181.61 25.4,181.61 26.67,182.88 26.67,184.15 | 17.78,181.61 13.97,185.42 13.97,229.87 19.05,234.95 24.13,234.95 27.94,238.76 | J19.3 186.34,81.63 189.23,78.74 189.23,76.2 191.77,73.66 208.28,73.66 | 242.57,74.93 241.3,73.66 208.28,73.66 | 242.57,74.93 242.57,78.74 239.68,81.63 J20.3 | J14.3 185.7,135.61 187.96,133.35 187.96,130.81 190.5,128.27 226.06,128.27 227.33,127 240.03,127 242.57,129.54 | 242.57,129.54 242.57,132.08 239.04,135.61 J15.3 | J9.3 186.34,189.58 187.96,187.96 187.96,184.15 189.23,182.88 198.12,182.88 199.39,184.15 210.82,184.15 | 210.82,184.15 227.33,184.15 229.87,181.61 240.03,181.61 242.57,184.15 | 242.57,184.15 242.57,187.96 240.95,189.58 J10.3 | J4.3 184.43,243.56 187.96,240.03 187.96,237.49 189.23,236.22 240.03,236.22 242.57,238.76 | 242.57,238.76 242.57,241.3 240.31,243.56 J5.3 | v120.65,193.04 v125.73,193.04 | 242.57,238.76 243.84,237.49 243.84,236.22 246.38,233.68 256.54,233.68 257.81,232.41 257.81,184.15 254,180.34 | 254,180.34 246.38,180.34 242.57,184.15 | 254,180.34 259.08,175.26 259.08,162.56 | 250.19,125.73 259.08,134.62 259.08,162.56 | 250.19,125.73 246.38,125.73 242.57,129.54 | 250.19,125.73 256.54,119.38 256.54,76.2 254,73.66 | 254,73.66 243.84,73.66 242.57,74.93 | 254,73.66 256.54,71.12 256.54,21.59 254,19.05 243.84,19.05 241.3,21.59 | v252.73,162.56 259.08,162.56 | IC3.18 106.68,50.8 102.87,50.8 100.33,48.26 IC3.5 100.33,44.45 96.52,40.64 12.7,40.64
  Bottom 0.508: ARD-5V.1 12.7,101.6 | R1.P$1 R6.P$2 210.82,184.15 | R7.P$2 100.33,127 | R4.P$1 46.99,74.93 | R10.P$2 207.01,20.32 | R8.P$2 208.28,73.66 | R35.P$2 R36.P$1 100.33,124.46 100.33,127
GND  (via drill 0.55)
  other vias: 49.53,256.54 115.57,255.27 175.26,256.54 234.95,256.54 233.68,210.82 168.91,213.36 128.27,210.82 87.63,201.93 46.99,204.47 33.02,163.83 93.98,163.83 153.67,184.15 187.96,170.18 229.87,151.13 40.64,115.57 78.74,114.3 60.96,90.17 163.83,99.06 218.44,97.79 167.64,49.53 201.93,50.8 236.22,49.53 44.45,58.42 49.53,35.56 46.99,219.71 222.25,190.5
  pour Top: 0,266.7 266.7,266.7 266.7,0 0,0
  pour Bottom: 0,266.7 266.7,266.7 266.7,0 0,0
GPIO1  (via drill 0.55)
  Top 0.254: J1.1 17.78,234.74 v17.78,231.14
  Bottom 0.254: v17.78,231.14 22.86,226.06 86.36,226.06 95.25,226.06 R27.P$2
GPIO2  (via drill 0.55)
  Top 0.254: v74.93,233.68 74.93,237.91 J2.1
  Bottom 0.254: v74.93,233.68 81.28,233.68 92.71,233.68 R28.P$2
GPIO3  (via drill 0.55)
  Top 0.254: v123.19,233.68 124.46,234.95 128.27,234.95 129.47,236.15 J3.1
  Bottom 0.254: v123.19,233.68 119.38,233.68 106.68,233.68 101.6,228.6 R29.P$2
GPIO4  (via drill 0.55)
  Top 0.254: R30.P$2 104.14,228.6 105.41,229.87 134.62,229.87 v139.7,224.79
  Bottom 0.254: v139.7,224.79 146.05,224.79 157.48,236.22 181.19,236.22 J4.1
GPIO5  (via drill 0.55)
  Top 0.254: v231.14,233.68 233.68,236.22 236.22,236.22 237.42,237.42 J5.1 | R31.P$2 106.68,226.06 107.95,224.79 137.16,224.79 v139.7,222.25
  Bottom 0.254: v231.14,233.68 158.75,233.68 147.32,222.25 v139.7,222.25
GPIO6  (via drill 0.55)
  Top 0.254: v36.83,213.36 13.97,190.5 13.97,185.42 16.51,182.88 19.9,182.88 J6.1
  Bottom 0.254: R33.P$2 109.22,226.06 106.68,223.52 46.99,223.52 v36.83,213.36
GPIO7  (via drill 0.55)
  Top 0.254: v52.07,187.96 81.28,217.17 v85.09,217.17
  Bottom 0.254: v52.07,187.96 57.15,182.88 73.87,182.88 J7.1 | R32.P$2 111.76,223.52 110.49,222.25 93.98,222.25 88.9,217.17 v85.09,217.17
GPIO8  (via drill 0.55)
  Top 0.254: v115.57,194.31 v115.57,187.96
  Bottom 0.254: v115.57,194.31 120.65,199.39 120.65,209.55 120.65,218.44 114.3,224.79 R34.P$2 | v115.57,187.96 120.65,182.88 127.85,182.88 J8.1
GPIO9
  Bottom 0.254: J9.1 183.44,182.17 180.34,179.07 153.67,179.07 152.4,177.8 R11.P$2
GPIO10  (via drill 0.55)
  Top 0.254: v223.52,181.61 224.79,182.88 235.8,182.88 J10.1
  Bottom 0.254: v223.52,181.61 219.71,177.8 156.21,177.8 154.94,176.53 R12.P$2
GPIO11  (via drill 0.55)
  Top 0.254: R13.P$2 154.94,170.18 143.51,170.18 v132.08,158.75
  Bottom 0.254: J11.1 20.53,129.54 17.78,129.54 16.51,130.81 16.51,138.43 22.86,144.78 123.19,144.78 132.08,153.67 v132.08,158.75
GPIO12  (via drill 0.55)
  Top 0.254: v52.07,133.35 v52.07,138.43 | v132.08,149.86 138.43,156.21 138.43,163.83 143.51,168.91 158.75,168.91 160.02,170.18 R14.P$2
  Bottom 0.254: v52.07,138.43 57.15,143.51 125.73,143.51 v132.08,149.86 | v52.07,133.35 55.88,129.54 74.51,129.54 J12.1
GPIO13  (via drill 0.55)
  Top 0.254: v121.92,138.43 119.38,135.89 v119.38,133.35 | R15.P$2 162.56,170.18 160.02,167.64 144.78,167.64 139.7,162.56 139.7,153.67 v130.81,144.78
  Bottom 0.254: v119.38,133.35 123.19,129.54 128.48,129.54 J13.1 | v130.81,144.78 127,140.97 124.46,140.97 v121.92,138.43
GPIO14  (via drill 0.55)
  Top 0.254: v168.91,137.16 171.45,134.62 v171.45,133.35
  Bottom 0.254: v168.91,137.16 162.56,137.16 149.86,149.86 149.86,166.37 151.13,167.64 170.18,167.64 173.99,171.45 173.99,173.99 172.72,175.26 167.64,175.26 R16.P$2 | v171.45,133.35 175.26,129.54 182.46,129.54 J14.1
GPIO15  (via drill 0.55)
  Top 0.254: v222.25,139.7 226.06,135.89 v226.06,133.35 | v180.34,172.72 177.8,170.18 168.91,170.18 167.64,171.45 R17.P$2
  Bottom 0.254: v226.06,133.35 229.87,129.54 236.43,129.54 J15.1 | v180.34,172.72 189.23,172.72 v222.25,139.7
GPIO16  (via drill 0.55)
  Top 0.254: v17.78,147.32 10.16,139.7 v10.16,132.08 | v10.16,76.2 11.43,74.93 19.9,74.93 J16.1 | v135.89,157.48 134.62,156.21 v130.81,156.21
  Bottom 0.254: v17.78,147.32 123.19,147.32 130.81,154.94 v130.81,156.21 | v10.16,132.08 v10.16,76.2 | v135.89,157.48 148.59,170.18 168.91,170.18 170.18,171.45 R18.P$2
GPIO17  (via drill 0.55)
  Top 0.254: v72.39,69.85 72.39,73.45 J17.1
  Bottom 0.254: R19.P$2 74.93,66.04 72.39,68.58 v72.39,69.85
GPIO18  (via drill 0.55)
  Top 0.254: v121.92,71.12 124.46,71.12 129.47,76.13 J18.1
  Bottom 0.254: R20.P$2 92.71,68.58 95.25,71.12 v121.92,71.12
GPIO19  (via drill 0.55)
  Top 0.254: v139.7,60.96 130.81,60.96 v127,64.77
  Bottom 0.254: J19.1 180.55,73.66 161.29,73.66 148.59,60.96 v139.7,60.96 | R21.P$2 95.25,67.31 97.79,69.85 121.92,69.85 v127,64.77
GPIO20  (via drill 0.55)
  Top 0.254: v213.36,69.85 217.17,73.66 234.53,73.66 J20.1 | v127,60.96 129.54,58.42 v139.7,58.42
  Bottom 0.254: v213.36,69.85 162.56,69.85 151.13,58.42 v139.7,58.42 | R22.P$2 97.79,67.31 99.06,68.58 119.38,68.58 v127,60.96
GPIO21  (via drill 0.55)
  Top 0.254: v34.29,52.07 12.7,30.48 12.7,25.4 16.51,21.59 20.53,21.59 J21.1
  Bottom 0.254: R23.P$2 100.33,63.5 99.06,62.23 44.45,62.23 v34.29,52.07
GPIO22  (via drill 0.55)
  Top 0.254: v67.31,25.4 66.04,25.4 64.77,26.67 64.77,41.91 85.09,62.23 101.6,62.23 102.87,63.5 R24.P$2
  Bottom 0.254: v67.31,25.4 68.58,24.13 68.58,22.86 69.85,21.59 74.51,21.59 J22.1
GPIO23  (via drill 0.55)
  Top 0.254: v118.11,26.67 120.65,29.21 120.65,41.91 113.03,49.53 113.03,59.69 110.49,62.23 107.95,62.23 105.41,64.77 R25.P$2
  Bottom 0.254: v118.11,26.67 118.11,22.86 119.38,21.59 128.48,21.59 J23.1
GPIO24  (via drill 0.55)
  Top 0.254: v171.45,30.48 173.99,27.94 v173.99,25.4 | R26.P$2 118.11,66.04 133.35,50.8 133.35,44.45 135.89,41.91 v139.7,41.91
  Bottom 0.254: v139.7,41.91 151.13,30.48 v171.45,30.48 | v173.99,25.4 177.8,21.59 182.46,21.59 J24.1
GPIO25  (via drill 0.55)
  Top 0.254: ARD-DIG-PIN.1 124.46,96.52 v139.7,111.76 | v251.46,101.6 256.54,96.52 256.54,21.59 247.65,12.7 v241.3,12.7 | v236.22,17.78 236.22,21.38 J25.1
  Bottom 0.254: v139.7,111.76 241.3,111.76 v251.46,101.6 | v241.3,12.7 v236.22,17.78
N$1
  Top 0.254: IC1.10 R27.P$1
N$3
  Top 0.254: IC1.11 R28.P$1
N$4
  Top 0.254: IC1.12 R29.P$1
N$5
  Top 0.254: IC1.13 R30.P$1
N$6
  Top 0.254: IC1.14 R31.P$1
N$7
  Top 0.254: IC1.15 R33.P$1
N$8
  Top 0.254: IC1.16 R32.P$1
N$9
  Top 0.254: IC1.17 R34.P$1
N$10
  Bottom 0.254: IC2.10 R11.P$1
N$12
  Bottom 0.254: IC2.11 R12.P$1
N$13
  Bottom 0.254: IC2.12 R13.P$1
N$14
  Bottom 0.254: IC2.13 R14.P$1
N$15
  Bottom 0.254: IC2.14 R15.P$1
N$16
  Bottom 0.254: IC2.15 R16.P$1
N$17
  Bottom 0.254: IC2.16 R17.P$1
N$18
  Bottom 0.254: IC2.17 R18.P$1
N$19
  Bottom 0.254: IC3.10 R19.P$1
N$20
  Bottom 0.254: IC3.11 R20.P$1
N$21
  Bottom 0.254: IC3.12 R21.P$1
N$22
  Bottom 0.254: IC3.13 R22.P$1
N$23
  Bottom 0.254: IC3.14 R23.P$1
N$24
  Bottom 0.254: IC3.15 R24.P$1
N$25
  Bottom 0.254: IC3.16 R25.P$1
N$26
  Bottom 0.254: IC3.17 R26.P$1
SCL  (via drill 0.55)
  Top 0.254: SCL.1 16.51,242.08 16.51,243.84 20.32,247.65 27.44,247.65 PAD2.1 51.93,242.71 54.75,239.89 71.26,239.89 | 71.26,239.89 69.85,241.3 69.85,243.84 73.66,247.65 81.42,247.65 PAD6.1 86.5,242.57 102.87,242.57 105.55,239.89 SCL2.1 124.6,239.89 123.19,241.3 123.19,243.84 127,247.65 138.43,247.65 140.33,245.75 PAD10.1 140.47,242.57 143.51,242.57 | 71.26,239.89 SCL1.1 | 179.21,239.89 177.8,241.3 177.8,243.84 181.61,247.65 190.5,247.65 194.3,243.85 PAD14.1 194.44,242.57 213.36,242.57 216.04,239.89 SCL4.1 232.55,239.89 231.14,241.3 231.14,243.84 234.95,247.65 243.84,247.65 248.28,243.21 PAD18.1 | 179.21,239.89 SCL3.1 | SCL5.1 16.02,185.91 15.24,186.69 15.24,189.23 20.32,194.31 27.94,194.31 32.38,189.87 PAD22.1 33.16,187.96 44.45,187.96 46.5,185.91 69.36,185.91 | 69.36,185.91 68.58,186.69 68.58,189.23 73.66,194.31 82.55,194.31 86.35,190.51 PAD26.1 104.63,188.74 107.46,185.91 SCL7.1 123.97,185.91 123.19,186.69 123.19,194.31 | 69.36,185.91 SCL6.1 | 135.89,194.31 140.33,189.87 PAD30.1 141.1,187.96 146.05,187.96 | 123.19,194.31 135.89,194.31 | 177.31,185.91 176.53,186.69 176.53,189.23 181.61,194.31 189.23,194.31 194.3,189.24 PAD34.1 | 177.31,185.91 SCL8.1 | PAD38.1 248.28,189.87 243.84,194.31 236.22,194.31 231.14,189.23 231.14,186.69 231.92,185.91 SCL9.1 216.68,185.91 213.85,188.74 PAD34.1 | SCL10.1 15.38,131.94 15.24,132.08 15.24,134.62 20.32,139.7 27.94,139.7 32.38,135.26 PAD42.1 44.31,134.76 48.4,130.67 68.72,130.67 | 68.72,130.67 68.58,130.81 68.58,135.89 73.66,140.97 81.28,140.97 86.35,135.9 PAD46.1 | 68.72,130.67 71.4,130.67 SCL11.1
  Top 0.254: 128.27,140.97 135.89,140.97 140.33,136.53 PAD50.1 147.32,134.76 | 128.27,140.97 123.19,135.89 123.19,132.08 124.6,130.67 | 124.6,130.67 125.38,130.67 SCL12.1 | 181.61,140.97 189.23,140.97 194.3,135.9 PAD54.1 213.22,134.76 217.31,130.67 232.55,130.67 | 181.61,140.97 177.8,137.16 177.8,132.08 179.21,130.67 | 179.21,130.67 179.35,130.67 SCL13.1 | PAD58.1 248.28,136.53 243.84,140.97 236.22,140.97 231.14,135.89 231.14,132.08 232.55,130.67 | 232.55,130.67 233.33,130.67 SCL14.1 | PAD62.1 32.38,81.92 27.94,86.36 20.32,86.36 15.24,81.28 15.24,78.74 16.02,77.96 SCL15.1 | 134.62,90.17 140.33,84.46 PAD70.1 143.51,80.79 | 134.62,90.17 129.54,90.17 123.19,83.82 123.19,78.74 123.97,77.96 SCL17.1 107.46,77.96 104.63,80.79 PAD66.1 86.35,81.29 81.28,86.36 73.66,86.36 69.85,82.55 69.85,78.74 70.63,77.96 SCL16.1 51.58,77.96 48.75,80.79 PAD62.1 | 178.58,77.96 177.8,78.74 177.8,81.28 182.88,86.36 190.5,86.36 194.3,82.56 PAD74.1 | 178.58,77.96 SCL18.1 | PAD78.1 248.28,81.92 243.84,86.36 236.22,86.36 231.14,81.28 231.14,78.74 231.92,77.96 SCL19.1 216.68,77.96 213.85,80.79 PAD74.1 | SCL20.1 16.65,23.99 15.24,25.4 15.24,27.94 19.05,31.75 27.94,31.75 32.38,27.31 PAD82.1 50.66,26.81 54.75,22.72 69.99,22.72 | 69.99,22.72 69.85,22.86 69.85,27.94 73.66,31.75 82.55,31.75 86.35,27.95 PAD86.1 86.5,26.67 104.14,26.67 106.82,23.99 SCL22.1 124.6,23.99 123.19,25.4 123.19,27.94 | SCL21.1 71.4,22.72 69.99,22.72 | 135.89,31.75 140.33,27.31 PAD90.1 140.47,26.67 161.29,26.67 163.97,23.99 179.21,23.99 | 123.19,27.94 127,31.75 135.89,31.75 | 179.21,23.99 177.8,25.4 177.8,27.94 181.61,31.75 190.5,31.75 194.3,27.95 PAD94.1 194.44,26.67
  Top 0.254: 179.21,23.99 SCL23.1 | PAD98.1 248.28,28.58 245.11,31.75 234.95,31.75 231.14,27.94 231.14,25.4 232.55,23.99 SCL24.1 216.04,23.99 213.36,26.67 194.44,26.67 | 143.51,242.57 158.75,242.57 161.43,239.89 179.21,239.89 | 146.05,187.96 157.48,187.96 159.53,185.91 177.31,185.91 | PAD46.1 104,134.76 108.09,130.67 124.6,130.67 | 147.32,134.76 159.88,134.76 163.97,130.67 179.21,130.67 | 143.51,80.79 159.24,80.79 162.07,77.96 178.58,77.96 | 143.51,80.79 143.51,39.37 135.89,31.75 | 134.62,90.17 134.62,99.06 147.32,111.76 147.32,121.92 | 147.32,121.92 147.32,134.76 | 128.27,140.97 128.27,158.75 146.05,176.53 146.05,187.96 | 135.89,194.31 137.16,195.58 137.16,208.28 143.51,214.63 143.51,242.57 | IC1.1 119.38,205.74 119.38,198.12 123.19,194.31 | IC2.1 181.61,142.24 181.61,140.97 | v118.11,46.99 123.19,41.91 123.19,27.94 | ARD-SCL.1 147.32,121.92 | R2.P$2 89.04,132.08 PAD46.1 | R1.P$2 197.34,191.77 PAD34.1 | R3.P$2 196.36,78.74 PAD74.1 | R5.P$2 196.99,24.13 194.44,26.67 | R4.P$2 35.56,76.2 35.56,78.74 33.51,80.79 PAD62.1
  Bottom 0.254: v118.11,46.99 IC3.1
  Bottom 0.508: R36.P$2 ARD-SCL.1
SDA
  Top 0.254: R7.P$1 88.75,129.54 PAD48.1 | R6.P$1 195.08,186.69 PAD36.1 | R8.P$1 196.07,76.2 PAD76.1 | R10.P$1 194.3,21.6 PAD96.1 | R9.P$1 32.38,76.84 PAD64.1
  Bottom 0.254: PAD4.1 34.29,241.8 34.29,243.84 | 34.29,243.84 34.29,245.11 31.75,247.65 22.86,247.65 18.7,243.49 SDA.1 | PAD8.1 88.9,242.44 88.9,243.84 | 88.9,243.84 88.9,245.11 86.36,247.65 76.2,247.65 72.67,244.12 SDA1.1 72.53,242.57 53.34,242.57 52.07,243.84 34.29,243.84 | 143.51,243.84 143.51,243.07 PAD12.1 140.33,231.77 134.62,226.06 134.62,194.31 | 143.51,243.84 143.51,245.11 140.97,247.65 129.54,247.65 126.65,244.76 SDA2.1 126.51,242.57 105.41,242.57 104.14,243.84 88.9,243.84 | PAD16.1 198.12,243.71 198.12,245.11 | 198.12,245.11 198.12,246.38 196.85,247.65 184.15,247.65 180.62,244.12 SDA3.1 180.48,242.57 160.02,242.57 158.75,243.84 143.51,243.84 | PAD20.1 251.46,243.08 251.46,246.38 250.19,247.65 238.76,247.65 234.6,243.49 SDA4.1 234.46,242.57 215.9,242.57 213.36,245.11 198.12,245.11 | PAD24.1 35.56,189.09 35.56,190.5 | SDA5.1 18.7,190.15 22.86,194.31 34.29,194.31 35.56,193.04 35.56,190.5 | PAD28.1 86.85,185.91 90.17,189.23 90.17,190.5 | 90.17,190.5 90.17,191.77 87.63,194.31 76.2,194.31 72.67,190.78 SDA6.1 61.45,188.74 59.69,190.5 35.56,190.5 | 143.51,190.5 143.51,189.09 PAD32.1 140.33,169.54 134.62,163.83 134.62,140.97 | 143.51,190.5 143.51,191.77 140.97,194.31 134.62,194.31 | 134.62,194.31 130.81,194.31 126.65,190.15 SDA7.1 122.41,188.74 120.65,190.5 106.68,190.5 | PAD40.1 249.41,185.91 252.73,189.23 252.73,191.77 250.19,194.31 233.68,194.31 233.33,193.96 | 233.33,193.96 233.33,190.5 234.6,189.23 SDA9.1 | 233.33,193.96 233.33,194.31 202.7,194.31 PAD36.1 198.12,189.73 198.12,190.5 194.31,194.31 184.15,194.31 180.62,190.78 SDA8.1 159.24,188.74 157.48,190.5 143.51,190.5
  Bottom 0.254: PAD44.1 35.56,135.12 35.56,135.89 | SDA10.1 18.7,135.54 22.86,139.7 33.02,139.7 35.56,137.16 35.56,135.89 | PAD48.1 90.17,135.75 90.17,135.89 | 90.17,135.89 90.17,138.43 87.63,140.97 76.2,140.97 72.67,137.44 SDA11.1 72.53,134.62 55.88,134.62 54.61,135.89 35.56,135.89 | 134.62,140.97 140.97,140.97 143.51,138.43 143.51,135.89 | 134.62,140.97 130.81,140.97 126.65,136.81 SDA12.1 126.51,134.62 109.22,134.62 107.95,135.89 90.17,135.89 | 143.51,135.89 143.51,135.12 PAD52.1 140.33,120.01 134.62,114.3 | PAD56.1 198.12,135.75 198.12,135.89 | 198.12,135.89 198.12,138.43 195.58,140.97 184.15,140.97 180.62,137.44 SDA13.1 179.49,135.89 175.26,135.89 | PAD60.1 252.73,136.39 252.73,138.43 250.19,140.97 237.49,140.97 234.6,138.08 SDA14.1 233.47,135.89 198.12,135.89 | PAD64.1 35.56,81.14 35.56,81.28 | SDA15.1 18.7,82.2 22.86,86.36 33.02,86.36 35.56,83.82 35.56,81.28 | PAD68.1 90.17,81.78 90.17,82.55 | 72.67,81.28 72.67,82.83 76.2,86.36 88.9,86.36 90.17,85.09 90.17,82.55 | 72.67,81.28 SDA16.1 | 143.51,81.28 143.51,81.14 PAD72.1 140.33,69.21 135.89,64.77 135.89,31.75 | 143.51,81.28 143.51,82.55 135.89,90.17 134.62,90.17 | 134.62,90.17 126.65,82.2 126.65,81.28 | 126.65,81.28 SDA17.1 | PAD76.1 198.12,81.78 198.12,82.55 | 180.62,81.28 180.62,81.56 185.42,86.36 195.58,86.36 198.12,83.82 198.12,82.55 | 180.62,81.28 SDA18.1 | PAD80.1 251.46,81.14 251.46,83.82 248.92,86.36 238.76,86.36 234.6,82.2 SDA19.1 218.93,80.79 217.17,82.55 198.12,82.55 | PAD84.1 35.56,27.17 35.56,27.94 | SDA20.1 18.7,28.86 21.59,31.75 33.02,31.75 35.56,29.21 35.56,27.94 | PAD88.1 88.9,26.54 88.9,29.21 | 88.9,29.21 88.9,30.48 87.63,31.75 76.2,31.75 72.67,28.22 SDA21.1 71.54,27.94 35.56,27.94
  Bottom 0.254: PAD92.1 143.51,27.17 143.51,27.94 | 135.89,31.75 142.24,31.75 143.51,30.48 143.51,27.94 | 135.89,31.75 129.54,31.75 126.65,28.86 SDA22.1 126.51,26.67 121.92,26.67 119.38,29.21 | PAD96.1 196.85,26.54 196.85,27.94 | 196.85,27.94 196.85,29.21 194.31,31.75 184.15,31.75 180.62,28.22 SDA23.1 180.48,26.67 176.53,26.67 175.26,27.94 143.51,27.94 | PAD100.1 250.19,25.9 250.19,29.21 247.65,31.75 237.49,31.75 234.6,28.86 SDA24.1 234.46,26.67 215.9,26.67 214.63,27.94 196.85,27.94 | 88.9,29.21 119.38,29.21 | 35.56,81.28 72.67,81.28 | 90.17,82.55 107.95,82.55 109.22,81.28 126.65,81.28 | 143.51,81.28 180.62,81.28 | 175.26,135.89 143.51,135.89 | 90.17,190.5 106.68,190.5 | 134.62,114.3 134.62,90.17 | IC1.2 114.3,205.74 106.68,198.12 106.68,190.5 | IC2.2 175.26,146.05 175.26,135.89 | IC3.2 119.38,35.56 119.38,29.21 | ARD-SDA.1 132.08,116.84 134.62,114.3
  Bottom 0.508: R35.P$1 ARD-SDA.1
VCC  (via drill 0.55)
  Top 0.508: PAD1.1 25.4,242.71 | 78.74,242.71 PAD5.1 | 134.62,242.57 137.37,242.57 PAD9.1 | 187.96,242.57 191.34,242.57 PAD13.1 | 241.3,242.57 245.32,242.57 PAD17.1 | PAD21.1 26.67,188.74 | 26.67,188.74 25.89,188.74 23.99,190.64 VCC5.1 | 80.5,188.74 PAD25.1 | 133.84,188.74 PAD29.1 | 188.45,188.74 PAD33.1 | 241.79,188.74 PAD37.1 | 26.67,134.62 29.42,134.62 PAD41.1 | 80.01,134.62 83.39,134.62 PAD45.1 | 134.62,134.62 137.37,134.62 PAD49.1 | 187.96,134.62 191.34,134.62 PAD53.1 | 242.57,134.62 PAD57.1 | 25.89,80.79 PAD61.1 | 80.01,80.79 79.23,80.79 77.96,82.06 VCC16.1 | 80.01,80.79 PAD65.1 | 133.84,80.79 PAD69.1 | 188.45,80.79 PAD73.1 | 241.79,80.79 PAD77.1 | 26.67,26.67 25.4,26.67 23.99,28.08 VCC20.1 | 26.67,26.67 29.42,26.67 PAD81.1 | 80.01,26.67 83.39,26.67 PAD85.1 | 133.35,26.67 137.37,26.67 PAD89.1 | 187.96,26.67 191.34,26.67 PAD93.1 | 241.3,26.67 245.32,26.67 PAD97.1 | 25.4,236.22 25.4,242.71 | 25.4,236.22 7.62,218.44 7.62,177.8 | 26.67,20.32 24.13,17.78 17.78,17.78 7.62,27.94 7.62,72.39 | 26.67,26.67 26.67,20.32 | 7.62,177.8 7.62,127 | 7.62,127 7.62,72.39 | 25.89,80.79 25.89,75.42 | 25.89,75.42 22.86,72.39 7.62,72.39 | 26.67,134.62 26.67,129.54 | 7.62,127 24.13,127 26.67,129.54 | 26.67,188.74 26.67,180.34 | 26.67,180.34 24.13,177.8 7.62,177.8 | 26.67,20.32 29.21,17.78 76.2,17.78 80.01,21.59 | 80.01,26.67 80.01,21.59 | 80.01,21.59 83.82,17.78 132.08,17.78 133.35,19.05 | 133.35,19.05 133.35,26.67 | 133.35,19.05 134.62,17.78 185.42,17.78 187.96,20.32 | 187.96,26.67 187.96,20.32 | 187.96,20.32 194.31,13.97 236.22,13.97 241.3,19.05 241.3,26.67 | 25.89,75.42 34.01,67.31 72.39,67.31 80.01,74.93 | 80.01,74.93 80.01,80.79 | 80.01,74.93 86.36,68.58 134.62,68.58
  Top 0.508: 133.84,80.79 133.84,75.42 130.81,72.39 134.62,68.58 | 134.62,68.58 v139.7,63.5 | v147.32,63.5 156.21,72.39 185.42,72.39 188.45,75.42 | 188.45,80.79 188.45,75.42 | 188.45,75.42 196.57,67.31 232.41,67.31 241.79,76.69 241.79,80.79 | 25.4,236.22 31.75,229.87 76.2,229.87 81.28,234.95 | 78.74,242.71 78.74,237.49 81.28,234.95 | 81.28,234.95 85.09,231.14 130.81,231.14 133.35,233.68 | 134.62,242.57 134.62,238.76 132.72,236.85 134.62,234.95 133.35,233.68 | 187.96,237.49 180.34,229.87 v147.32,229.87 | 187.96,242.57 187.96,237.49 | v139.7,227.33 133.35,233.68 | 187.96,237.49 194.31,231.14 234.95,231.14 241.3,237.49 241.3,242.57 | 26.67,180.34 29.21,177.8 49.53,177.8 52.07,180.34 77.47,180.34 80.5,183.37 | 80.5,188.74 80.5,183.37 | 80.5,183.37 83.54,180.34 130.81,180.34 133.84,183.37 | 133.84,183.37 133.84,188.74 | 133.84,183.37 134.13,183.37 137.16,180.34 v143.51,180.34 | v149.86,180.34 185.42,180.34 188.45,183.37 | 188.45,188.74 188.45,183.37 | 188.45,183.37 191.49,180.34 238.76,180.34 241.79,183.37 241.79,188.74 | 26.67,129.54 29.21,127 77.47,127 80.01,129.54 | 80.01,134.62 80.01,129.54 | 80.01,129.54 82.55,127 130.81,127 134.62,130.81 | 134.62,134.62 134.62,130.81 | 134.62,130.81 138.43,127 v143.51,127 | v151.13,127 185.42,127 187.96,129.54 | 187.96,129.54 187.96,134.62 | 187.96,129.54 190.5,127 240.03,127 242.57,129.54 242.57,134.62 | 25.4,242.71 25.4,244.03 VCC.1 | 78.74,242.71 78.74,244.67 VCC1.1 | VCC2.1 131.94,245.25 134.62,242.57 | VCC3.1 185.91,244.62 187.96,242.57 | VCC4.1 239.89,243.98 241.3,242.57 | 80.5,188.74 77.96,191.28 VCC6.1 | 133.84,188.74 131.94,190.64 VCC7.1 | 188.45,188.74 185.91,191.28 VCC8.1
  Top 0.508: 241.79,188.74 239.89,190.64 VCC9.1 | VCC14.1 239.89,137.3 242.57,134.62 | VCC13.1 185.91,136.67 187.96,134.62 | VCC12.1 131.94,137.3 134.62,134.62 | VCC11.1 77.96,136.67 80.01,134.62 | VCC10.1 23.99,137.3 26.67,134.62 | 25.89,80.79 23.99,82.69 VCC15.1 | 133.84,80.79 131.94,82.69 VCC17.1 131.94,85.23 v129.54,87.63 | 188.45,80.79 185.91,83.33 VCC18.1 | 241.79,80.79 239.89,82.69 VCC19.1 | VCC21.1 77.96,28.72 80.01,26.67 | VCC22.1 131.94,28.08 133.35,26.67 | VCC23.1 185.91,28.72 187.96,26.67 | VCC24.1 239.89,28.08 241.3,26.67 | DECOUP-CAP.P$1 109.86,106.68 ARD-VCC.1
  Bottom 0.254: v139.7,227.33 144.78,227.33 v147.32,229.87
  Bottom 0.508: v139.7,63.5 v147.32,63.5 | v143.51,180.34 v149.86,180.34 | v143.51,127 v151.13,127 | ARD-VCC.1 129.54,99.06 v129.54,87.63

### Text on the board
tNames: Board made by: Caleb Wright / CU Boulder - TAM Capstone / Base Board v5.2 / cawr2975@colorado.edu
bNames: This resistor pad / is for a decoupling / capacitor. No resistor